# Altium project Hammerhead.PrjPCB (part 1 of 2)
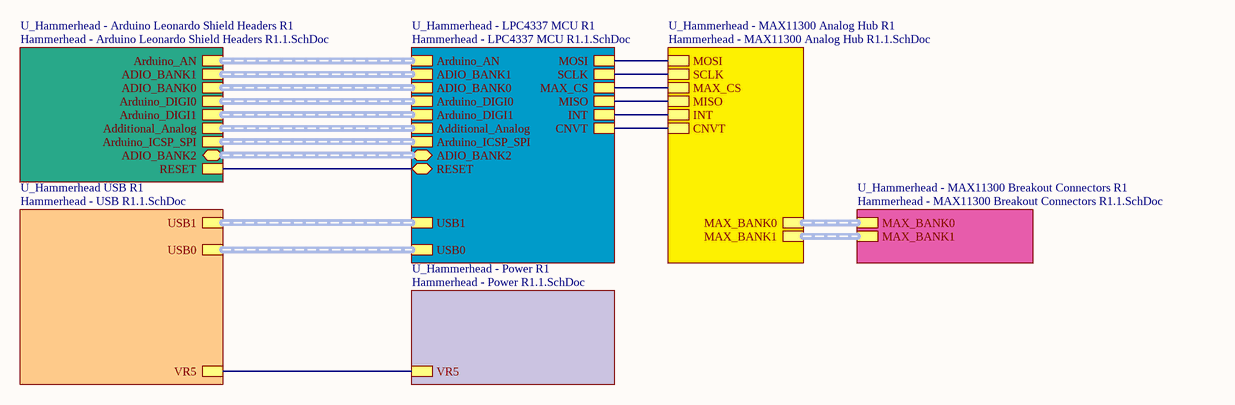
[diagram p0: Hammerhead - Master Schematic.SchDoc]
7 sheets, 195 parts. Net scope: hierarchical (ports join the sheet entries above them; power ports are global).
Board file: Hammerhead PCB R1.0.PcbDoc
Sheets:
  Hammerhead - Master Schematic.SchDoc
    U_Hammerhead - Arduino Leonardo Shield Headers R1 = Hammerhead - Arduino Leonardo Shield Headers R1.1.SchDoc
    U_Hammerhead - LPC4337 MCU R1 = Hammerhead - LPC4337 MCU R1.1.SchDoc
    U_Hammerhead - MAX11300 Analog Hub R1 = Hammerhead - MAX11300 Analog Hub R1.1.SchDoc
    U_Hammerhead - MAX11300 Breakout Connectors R1 = Hammerhead - MAX11300 Breakout Connectors R1.1.SchDoc
    U_Hammerhead - Power R1 = Hammerhead - Power R1.1.SchDoc
    U_Hammerhead USB R1 = Hammerhead - USB R1.1.SchDoc

## Sheet Hammerhead - Master Schematic.SchDoc
size A; Author: Adam Vadala-Roth; DrawnBy: Adam Vadala-Roth; Engineer: Adam Vadala-Roth; DocumentNumber: 1

### Sub-sheets
U_Hammerhead - Arduino Leonardo Shield Headers R1 = Hammerhead - Arduino Leonardo Shield Headers R1.1.SchDoc: Arduino_AN (harness Arduino_AN), Arduino_DIGI0 (harness Arduino_DIGI0), Arduino_DIGI1 (harness Arduino_DIGI1), RESET, Additional_Analog (harness ADAN), ADIO_BANK1 (harness ADIO_BANK1), ADIO_BANK0 (harness ADIO_BANK0), Arduino_ICSP_SPI (harness Arduino_ICSP_SPI), ADIO_BANK2 (harness ADIO_BANK2)
U_Hammerhead - LPC4337 MCU R1 = Hammerhead - LPC4337 MCU R1.1.SchDoc: Arduino_AN (harness Arduino_AN), ADIO_BANK1 (harness ADIO_BANK1), ADIO_BANK0 (harness ADIO_BANK0), Arduino_DIGI0 (harness Arduino_DIGI0), Arduino_DIGI1 (harness Arduino_DIGI1), Additional_Analog (harness ADAN), USB1 (harness USB1), USB0 (harness USB0), Arduino_ICSP_SPI (harness Arduino_ICSP_SPI), MOSI, SCLK, MAX_CS, MISO, INT, CNVT, RESET, ADIO_BANK2 (harness ADIO_BANK2)
U_Hammerhead - MAX11300 Analog Hub R1 = Hammerhead - MAX11300 Analog Hub R1.1.SchDoc: MOSI, SCLK, MAX_CS, MISO, INT, CNVT, MAX_BANK0 (harness MAX_BANK0), MAX_BANK1 (harness MAX_BANK1)
U_Hammerhead - MAX11300 Breakout Connectors R1 = Hammerhead - MAX11300 Breakout Connectors R1.1.SchDoc: MAX_BANK0 (harness MAX_BANK0), MAX_BANK1 (harness MAX_BANK1)
U_Hammerhead - Power R1 = Hammerhead - Power R1.1.SchDoc: VR5
U_Hammerhead USB R1 = Hammerhead - USB R1.1.SchDoc: USB1 (harness USB1), USB0 (harness USB0), VR5

### Nets
CNVT: sheet U_Hammerhead - LPC4337 MCU R1/CNVT, sheet U_Hammerhead - MAX11300 Analog Hub R1/CNVT
INT: sheet U_Hammerhead - LPC4337 MCU R1/INT, sheet U_Hammerhead - MAX11300 Analog Hub R1/INT
MAX_CS: sheet U_Hammerhead - LPC4337 MCU R1/MAX_CS, sheet U_Hammerhead - MAX11300 Analog Hub R1/MAX_CS
MISO: sheet U_Hammerhead - LPC4337 MCU R1/MISO, sheet U_Hammerhead - MAX11300 Analog Hub R1/MISO
MOSI: sheet U_Hammerhead - LPC4337 MCU R1/MOSI, sheet U_Hammerhead - MAX11300 Analog Hub R1/MOSI
RESET: sheet U_Hammerhead - Arduino Leonardo Shield Headers R1/RESET, sheet U_Hammerhead - LPC4337 MCU R1/RESET
SCLK: sheet U_Hammerhead - LPC4337 MCU R1/SCLK, sheet U_Hammerhead - MAX11300 Analog Hub R1/SCLK
NetD3_1: sheet U_Hammerhead - Power R1/VR5, sheet U_Hammerhead USB R1/VR5

### Buses and harness runs
harness sheet U_Hammerhead - Arduino Leonardo Shield Headers R1/Additional_Analog = sheet U_Hammerhead - LPC4337 MCU R1/Additional_Analog
harness sheet U_Hammerhead - Arduino Leonardo Shield Headers R1/ADIO_BANK0 = sheet U_Hammerhead - LPC4337 MCU R1/ADIO_BANK0
harness sheet U_Hammerhead - Arduino Leonardo Shield Headers R1/ADIO_BANK1 = sheet U_Hammerhead - LPC4337 MCU R1/ADIO_BANK1
harness sheet U_Hammerhead - Arduino Leonardo Shield Headers R1/ADIO_BANK2 = sheet U_Hammerhead - LPC4337 MCU R1/ADIO_BANK2
harness sheet U_Hammerhead - Arduino Leonardo Shield Headers R1/Arduino_AN = sheet U_Hammerhead - LPC4337 MCU R1/Arduino_AN
harness sheet U_Hammerhead - Arduino Leonardo Shield Headers R1/Arduino_DIGI0 = sheet U_Hammerhead - LPC4337 MCU R1/Arduino_DIGI0
harness sheet U_Hammerhead - Arduino Leonardo Shield Headers R1/Arduino_DIGI1 = sheet U_Hammerhead - LPC4337 MCU R1/Arduino_DIGI1
harness sheet U_Hammerhead - Arduino Leonardo Shield Headers R1/Arduino_ICSP_SPI = sheet U_Hammerhead - LPC4337 MCU R1/Arduino_ICSP_SPI
harness sheet U_Hammerhead - LPC4337 MCU R1/USB0 = sheet U_Hammerhead USB R1/USB0
harness sheet U_Hammerhead - LPC4337 MCU R1/USB1 = sheet U_Hammerhead USB R1/USB1
harness sheet U_Hammerhead - MAX11300 Analog Hub R1/MAX_BANK0 = sheet U_Hammerhead - MAX11300 Breakout Connectors R1/MAX_BANK0
harness sheet U_Hammerhead - MAX11300 Analog Hub R1/MAX_BANK1 = sheet U_Hammerhead - MAX11300 Breakout Connectors R1/MAX_BANK1

## Sheet Hammerhead - Arduino Leonardo Shield Headers R1.1.SchDoc
size A; SheetNumber: 5
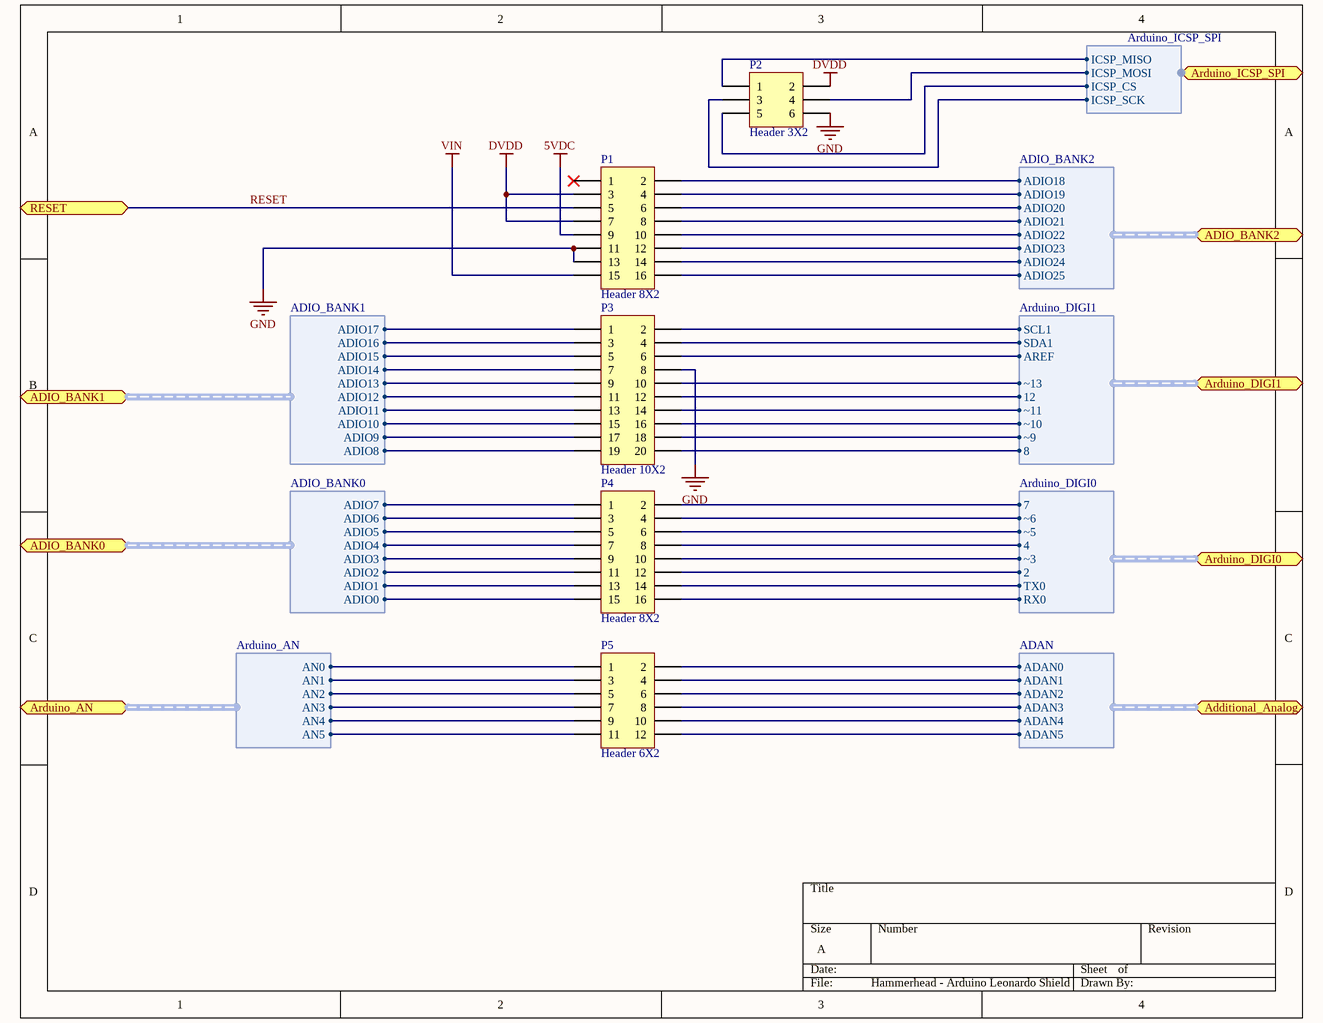
[diagram p1: Hammerhead - Arduino Leonardo Shield Headers R1.1.SchDoc]

### Parts
P1  Header 8X2  [HDR2X8]
P2  Header 3X2  [HDR2X3]
P3  Header 10X2  [HDR2X10]
P4  Header 8X2  [HDR2X8]
P5  Header 6X2  [HDR2X6]

### Ports
Additional_Analog (harness ADAN), ADIO_BANK0 (harness ADIO_BANK0), ADIO_BANK1 (harness ADIO_BANK1), ADIO_BANK2 (harness ADIO_BANK2), Arduino_AN (harness Arduino_AN), Arduino_DIGI0 (harness Arduino_DIGI0), Arduino_DIGI1 (harness Arduino_DIGI1), Arduino_ICSP_SPI (harness Arduino_ICSP_SPI), RESET

### Harnesses
Arduino_DIGI1: 8, ~9, ~10, ~11, 12, ~13, AREF, SDA1, SCL1
Arduino_DIGI0: 7, ~6, ~5, 4, ~3, 2, TX0, RX0
Arduino_AN: AN0, AN1, AN2, AN3, AN4, AN5
ADIO_BANK0: ADIO0, ADIO1, ADIO2, ADIO3, ADIO4, ADIO5, ADIO6, ADIO7
ADIO_BANK1: ADIO17, ADIO16, ADIO15, ADIO14, ADIO13, ADIO12, ADIO10, ADIO9, ADIO8, ADIO11
ADAN: ADAN0, ADAN1, ADAN2, ADAN3, ADAN4, ADAN5
Arduino_ICSP_SPI: ICSP_MOSI, ICSP_MISO, ICSP_SCK, ICSP_CS
ADIO_BANK2: ADIO18, ADIO19, ADIO20, ADIO21, ADIO22, ADIO23, ADIO24, ADIO25

### Nets
5VDC: P1.9
DVDD: P1.3 P1.7 P2.2
GND: P1.11 P1.13 P2.6 P3.8
VIN: P1.15
ADC0_5: P5.2 ; port Additional_Analog.ADAN0
ADC0_7: P5.4 ; port Additional_Analog.ADAN1
AN0: P5.1 ; port Arduino_AN.AN0
AN1: P5.3 ; port Arduino_AN.AN1
AN2: P5.5 ; port Arduino_AN.AN2
AN3: P5.7 ; port Arduino_AN.AN3
AN4: P5.9 ; port Arduino_AN.AN4
Digi_2: P4.12 ; port Arduino_DIGI0.2
GPIO1_0: P3.3 ; port ADIO_BANK1.ADIO16
GPIO1_1: P3.5 ; port ADIO_BANK1.ADIO15
GPIO1_3: P3.7 ; port ADIO_BANK1.ADIO14
GPIO1_5: P3.9 ; port ADIO_BANK1.ADIO13
GPIO1_9: P3.1 ; port ADIO_BANK1.ADIO17
GPIO1_10: P5.12 ; port Additional_Analog.ADAN5
GPIO1_12: P3.17 ; port ADIO_BANK1.ADIO9
GPIO1_13: P3.19 ; port ADIO_BANK1.ADIO8
GPIO2_0: P4.10 ; port Arduino_DIGI0.~3
GPIO2_2: P4.3 ; port ADIO_BANK0.ADIO6
GPIO2_5: P4.1 ; port ADIO_BANK0.ADIO7
GPIO2_6: P3.16 ; port Arduino_DIGI1.~10
GPIO2_7: P4.4 ; port Arduino_DIGI0.~6
GPIO2_8: P3.20 ; port Arduino_DIGI1.8
GPIO2_9: P3.18 ; port Arduino_DIGI1.~9
GPIO2_12: P3.11 ; port ADIO_BANK1.ADIO12
GPIO2_14: P4.6 ; port Arduino_DIGI0.~5
GPIO3_0: P1.2 ; port ADIO_BANK2.ADIO18
GPIO3_1: P1.6 ; port ADIO_BANK2.ADIO20
GPIO3_2: P1.8 ; port ADIO_BANK2.ADIO21
GPIO3_3: P4.14 ; port Arduino_DIGI0.TX0
GPIO3_4: P4.16 ; port Arduino_DIGI0.RX0
GPIO3_5: P4.8 ; port Arduino_DIGI0.4
GPIO3_6: P5.10 ; port Additional_Analog.ADAN4
GPIO3_8: P4.5 ; port ADIO_BANK0.ADIO5
GPIO3_9: P4.7 ; port ADIO_BANK0.ADIO4
GPIO3_10: P4.11 ; port ADIO_BANK0.ADIO2
GPIO3_11: P4.15 ; port ADIO_BANK0.ADIO0
GPIO3_14: P4.2 ; port Arduino_DIGI0.7
GPIO4_11: P3.15 ; port ADIO_BANK1.ADIO10
GPIO5_6: P5.6 ; port Additional_Analog.ADAN2
GPIO5_7: P5.8 ; port Additional_Analog.ADAN3
GPIO5_8: P4.9 ; port ADIO_BANK0.ADIO3
GPIO5_9: P4.13 ; port ADIO_BANK0.ADIO1
GPIO5_12: P3.14 ; port Arduino_DIGI1.~11
GPIO5_13: P3.12 ; port Arduino_DIGI1.12
GPIO5_14: P3.10 ; port Arduino_DIGI1.~13
GPIO5_15: P1.14 ; port ADIO_BANK2.ADIO24
GPIO5_16: P1.16 ; port ADIO_BANK2.ADIO25
GPIO5_18: P3.13 ; port ADIO_BANK1.ADIO11
I2C1_SCL: P3.2 ; port Arduino_DIGI1.SCL1
I2C1_SDA: P3.4 ; port Arduino_DIGI1.SDA1
RESET: P1.5 ; port RESET
SGPIO6: P1.12 ; port ADIO_BANK2.ADIO23
SSP1_MISO: P2.1 ; port Arduino_ICSP_SPI.ICSP_MISO
SSP1_MOSI: P2.4 ; port Arduino_ICSP_SPI.ICSP_MOSI
SSP1_SCK: P2.3 ; port Arduino_ICSP_SPI.ICSP_SCK
SSP1_SSEL: P2.5 ; port Arduino_ICSP_SPI.ICSP_CS
U0_RXD: P1.10 ; port ADIO_BANK2.ADIO22
U0_TXD: P1.4 ; port ADIO_BANK2.ADIO19
VDDA: P3.6 ; port Arduino_DIGI1.AREF
NetP5_11: P5.11 ; port Arduino_AN.AN5

Not connected (* = marked no-connect by the designer): P1 1*

### Library data of the parts
P1 P4 = Header 8X2: Header, 8-Pin, Dual row; LatestRevisionDate: 17-Jul-2002; LatestRevisionNote: Re-released for DXP Platform.; Publisher: Altium Limited
P2 = Header 3X2: Header, 3-Pin, Dual row; LatestRevisionDate: 17-Jul-2002; LatestRevisionNote: Re-released for DXP Platform.; Publisher: Altium Limited
P3 = Header 10X2: Header, 10-Pin, Dual row; LatestRevisionDate: 17-Jul-2002; LatestRevisionNote: Re-released for DXP Platform.; Publisher: Altium Limited
P5 = Header 6X2: Header, 6-Pin, Dual row; LatestRevisionDate: 17-Jul-2002; LatestRevisionNote: Re-released for DXP Platform.; Publisher: Altium Limited

## Sheet Hammerhead - LPC4337 MCU R1.1.SchDoc
size C; SheetNumber: 2
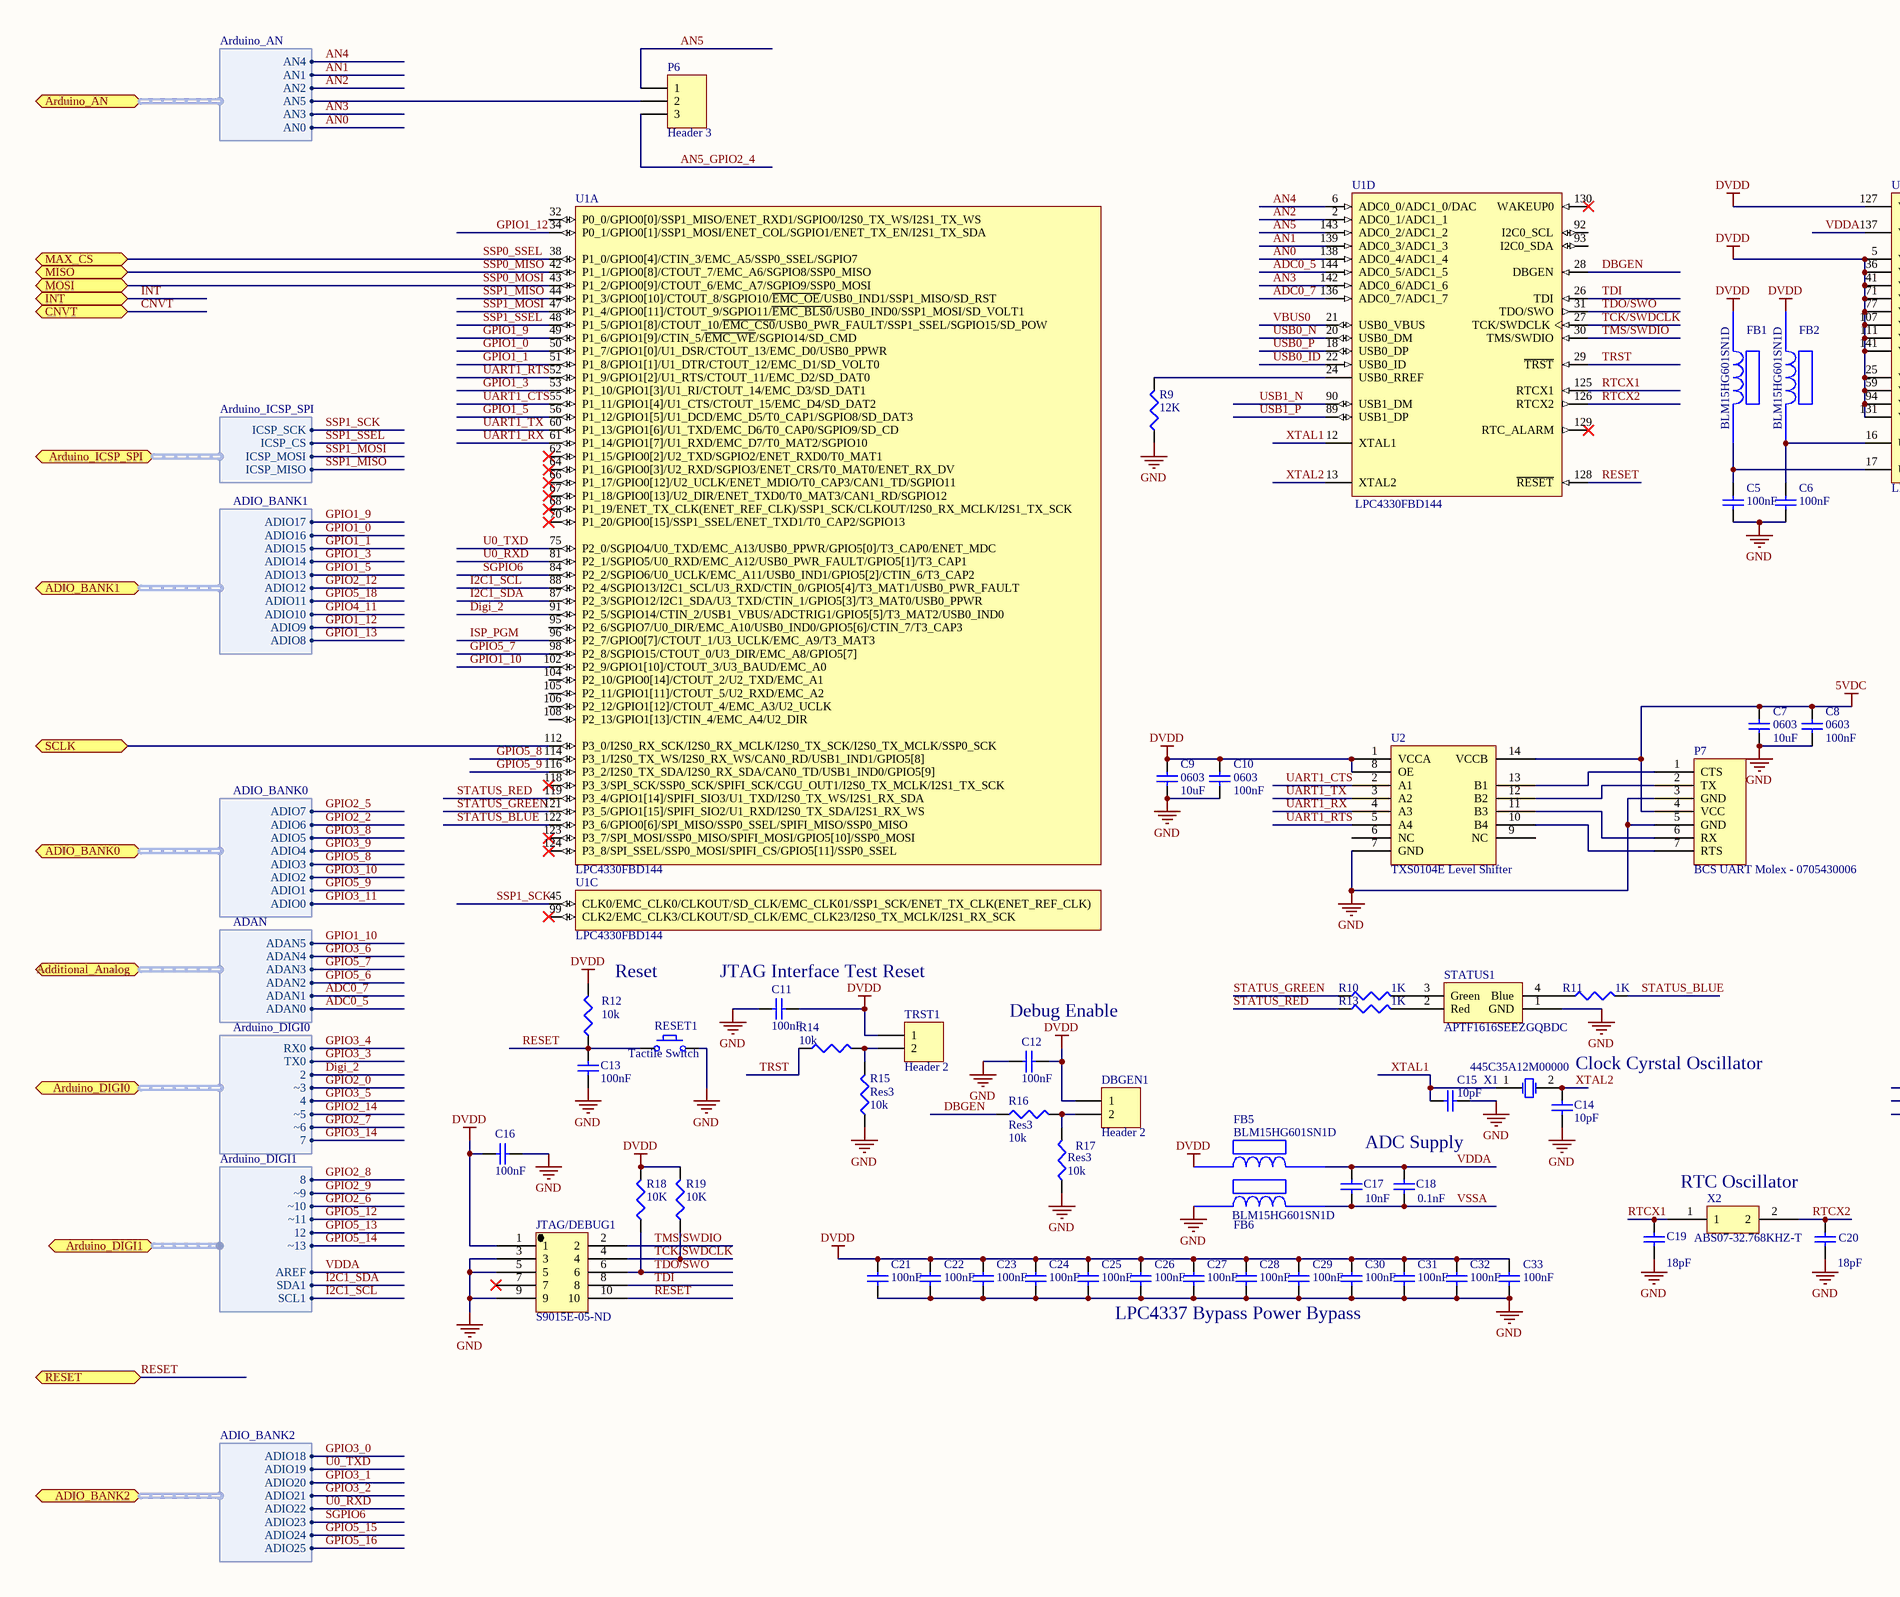
[diagram p2: Hammerhead - LPC4337 MCU R1.1.SchDoc, left]
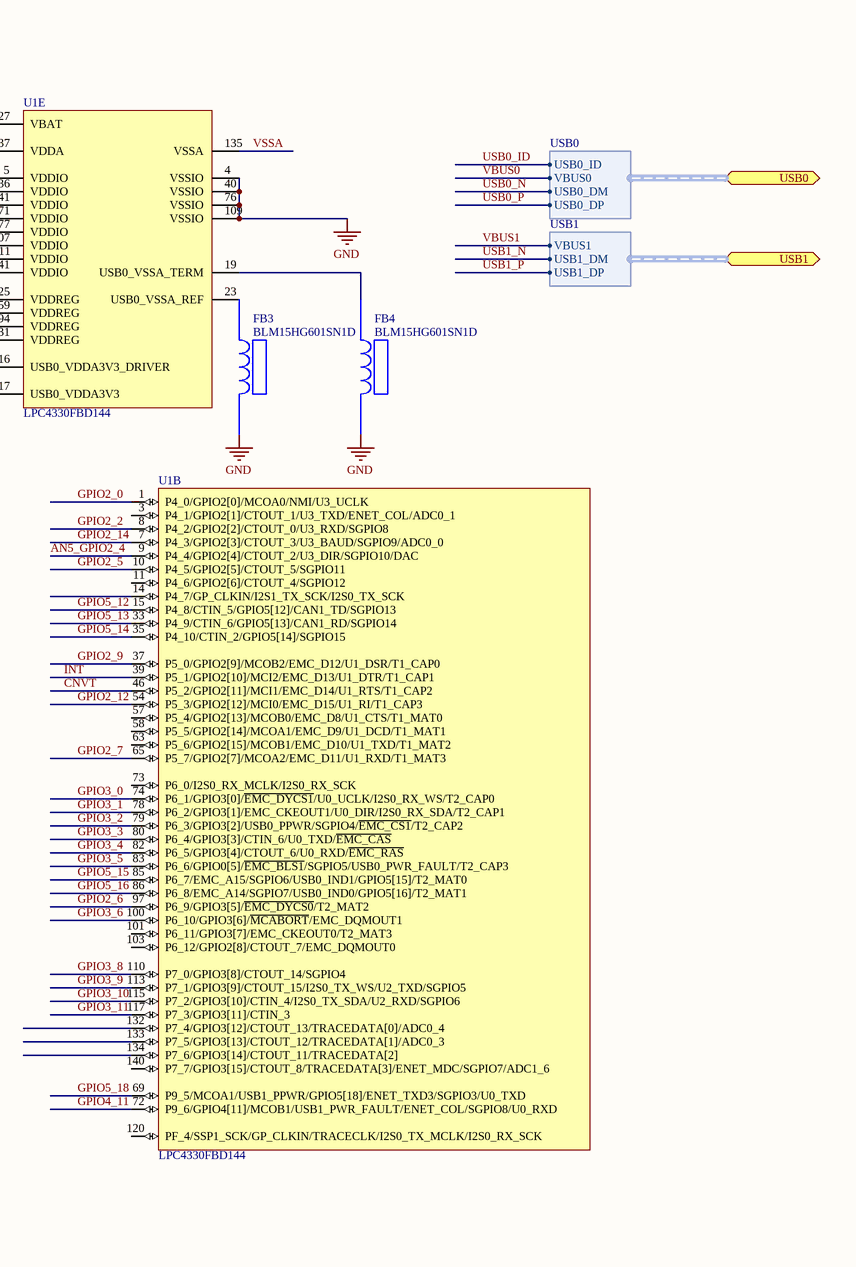
[diagram p3: Hammerhead - LPC4337 MCU R1.1.SchDoc, right]

### Parts
C5  value 100nF  [1608[0603]]  (hidden comment: Cap Semi)
C6  value 100nF  [1608[0603]]  (hidden comment: Cap Semi)
C7  0603  value 10uF  [1608[0603]]
C8  0603  value 100nF  [1608[0603]]
C9  0603  value 10uF  [1608[0603]]
C10  0603  value 100nF  [1608[0603]]
C11  value 100nF  [1608[0603]]  (hidden comment: Cap Semi)
C12  value 100nF  [1608[0603]]  (hidden comment: Cap Semi)
C13  value 100nF  [1608[0603]]  (hidden comment: Cap Semi)
C14  value 10pF  [1608[0603]]  (hidden comment: Cap Semi)
C15  value 10pF  [1608[0603]]  (hidden comment: Cap Semi)
C16  value 100nF  [1608[0603]]  (hidden comment: Cap Semi)
C17  value 10nF  [1608[0603]]  (hidden comment: Cap Semi)
C18  value 0.1nF  [1608[0603]]  (hidden comment: Cap Semi)
C19  value 18pF  [1608[0603]]  (hidden comment: Cap Semi)
C20  value 18pF  [1608[0603]]  (hidden comment: Cap Semi)
C21  value 100nF  [1608[0603]]  (hidden comment: Cap Semi)
C22  value 100nF  [1608[0603]]  (hidden comment: Cap Semi)
C23  value 100nF  [1608[0603]]  (hidden comment: Cap Semi)
C24  value 100nF  [1608[0603]]  (hidden comment: Cap Semi)
C25  value 100nF  [1608[0603]]  (hidden comment: Cap Semi)
C26  value 100nF  [1608[0603]]  (hidden comment: Cap Semi)
C27  value 100nF  [1608[0603]]  (hidden comment: Cap Semi)
C28  value 100nF  [1608[0603]]  (hidden comment: Cap Semi)
C29  value 100nF  [1608[0603]]  (hidden comment: Cap Semi)
C30  value 100nF  [1608[0603]]  (hidden comment: Cap Semi)
C31  value 100nF  [1608[0603]]  (hidden comment: Cap Semi)
C32  value 100nF  [1608[0603]]  (hidden comment: Cap Semi)
C33  value 100nF  [1608[0603]]  (hidden comment: Cap Semi)
DBGEN1  Header 2  [HDR1X2]
FB1  BLM15HG601SN1D  [BLM18PG121SN1D]
FB2  BLM15HG601SN1D  [BLM18PG121SN1D]
FB3  BLM15HG601SN1D  [BLM18PG121SN1D]
FB4  BLM15HG601SN1D  [BLM18PG121SN1D]
FB5  BLM15HG601SN1D  [BLM18PG121SN1D]
FB6  BLM15HG601SN1D  [BLM18PG121SN1D]
JTAG/DEBUG1  S9015E-05-ND  [S9015E-05-ND]
P6  Header 3  [HDR1X3]
P7  BCS UART Molex - 0705430006  [BCS Serial Port - Molex]
R9  value 12K  [J1-0603]  (hidden comment: Res3)
R10  value 1K  [J1-0603]  (hidden comment: Res3)
R11  value 1K  [J1-0603]  (hidden comment: Res3)
R12  value 10k  [J1-0603]  (hidden comment: Res3)
R13  value 1K  [J1-0603]  (hidden comment: Res3)
R14  value 10k  [J1-0603]  (hidden comment: Res3)
R15  Res3  value 10k  [J1-0603]
R16  Res3  value 10k  [J1-0603]
R17  Res3  value 10k  [J1-0603]
R18  value 10K  [J1-0603]  (hidden comment: Res3)
R19  value 10K  [J1-0603]  (hidden comment: Res3)
RESET1  Tactile Switch  [TL3301]
STATUS1  APTF1616SEEZGQBDC  [RGB LED APTF1616SEEZGQBDC]
TRST1  Header 2  [HDR1X2]
U1  LPC4330FBD144  [SOT486-1_V]  (parts A,B,C,D,E of 5)
U2  TXS0104E Level Shifter  [RGY  (S-PVQFN-N14)]
X1  445C35A12M00000  [445C35A12M00000]
X2  ABS07-32.768KHZ-T  [ABS07-32.768KHZ-T]

### Ports
Additional_Analog (harness ADAN), ADIO_BANK0 (harness ADIO_BANK0), ADIO_BANK1 (harness ADIO_BANK1), ADIO_BANK2 (harness ADIO_BANK2), Arduino_AN (harness Arduino_AN), Arduino_DIGI0 (harness Arduino_DIGI0), Arduino_DIGI1 (harness Arduino_DIGI1), Arduino_ICSP_SPI (harness Arduino_ICSP_SPI), CNVT, INT, MAX_CS, MISO, MOSI, RESET, SCLK, USB0 (harness USB0), USB1 (harness USB1)

### Harnesses
Arduino_AN: AN0, AN1, AN2, AN3, AN4, AN5
ADIO_BANK0: ADIO0, ADIO1, ADIO2, ADIO3, ADIO4, ADIO5, ADIO6, ADIO7
ADIO_BANK1: ADIO17, ADIO16, ADIO15, ADIO14, ADIO13, ADIO12, ADIO10, ADIO9, ADIO8, ADIO11
Arduino_DIGI0: 7, ~6, ~5, 4, ~3, 2, TX0, RX0
ADAN: ADAN0, ADAN1, ADAN2, ADAN3, ADAN4, ADAN5
USB1: VBUS1, USB1_DM, USB1_DP
USB0: USB0_ID, VBUS0, USB0_DM, USB0_DP
Arduino_ICSP_SPI: ICSP_MOSI, ICSP_MISO, ICSP_SCK, ICSP_CS
Arduino_DIGI1: 8, ~9, ~10, ~11, 12, ~13, AREF, SDA1, SCL1
ADIO_BANK2: ADIO18, ADIO19, ADIO20, ADIO21, ADIO22, ADIO23, ADIO24, ADIO25

### Nets
5VDC: C7.2 C8.2 P7.4(VCC) U2.14(VCCB)
DVDD: C9.2 C10.2 C11.2 C12.2 C16.1 C21.2 C22.2 C23.2 C24.2 C25.2 C26.2 C27.2 C28.2 C29.2 C30.2 C31.2 C32.2 C33.2 DBGEN1.1 FB1.1 FB2.1 FB5.1 JTAG/DEBUG1.1 R12.2 R18.2 R19.2 TRST1.1 U1.5(VDDIO) U1.25(VDDREG) U1.36(VDDIO) U1.41(VDDIO) U1.59(VDDREG) U1.71(VDDIO) U1.77(VDDIO) U1.94(VDDREG) U1.107(VDDIO) U1.111(VDDIO) U1.127(VBAT) U1.131(VDDREG) U1.141(VDDIO) U2.1(VCCA) U2.8(OE)
GND: C5.1 C6.1 C7.1 C8.1 C9.1 C10.1 C11.1 C12.1 C13.1 C14.1 C15.1 C16.2 C19.1 C20.1 C21.1 C22.1 C23.1 C24.1 C25.1 C26.1 C27.1 C28.1 C29.1 C30.1 C31.1 C32.1 C33.1 FB3.2 FB4.2 FB6.1 JTAG/DEBUG1.3 JTAG/DEBUG1.5 JTAG/DEBUG1.9 P7.3(GND) P7.5(GND) R9.1 R15.1 R17.1 RESET1.2 STATUS1.1(GND) U1.4(VSSIO) U1.40(VSSIO) U1.76(VSSIO) U1.109(VSSIO) U2.7(GND)
ADC0_5: U1.144(ADC0_5/ADC1_5) ; port Additional_Analog.ADAN0
ADC0_7: U1.136(ADC0_7/ADC1_7) ; port Additional_Analog.ADAN1
AN0: U1.138(ADC0_4/ADC1_4) ; port Arduino_AN.AN0
AN1: U1.139(ADC0_3/ADC1_3) ; port Arduino_AN.AN1
AN2: U1.2(ADC0_1/ADC1_1) ; port Arduino_AN.AN2
AN3: U1.142(ADC0_6/ADC1_6) ; port Arduino_AN.AN3
AN4: U1.6(ADC0_0/ADC1_0/DAC) ; port Arduino_AN.AN4
AN5: P6.1 U1.143(ADC0_2/ADC1_2)
AN5_GPIO2_4: P6.3 U1.9(P4_4/GPIO2[4]/CTOUT_2/U3_DIR/SGPIO10/DAC)
CNVT: U1.46(P5_2/GPIO2[11]/MCI1/EMC_D14/U1_RTS/T1_CAP2) ; port CNVT
DBGEN: R16.1 U1.28(DBGEN)
Digi_2: U1.91(P2_5/SGPIO14/CTIN_2/USB1_VBUS/ADCTRIG1/GPIO5[5]/T3_MAT2/USB0_IND0) ; port Arduino_DIGI0.2
GPIO1_0: U1.50(P1_7/GPIO1[0]/U1_DSR/CTOUT_13/EMC_D0/USB0_PPWR) ; port ADIO_BANK1.ADIO16
GPIO1_1: U1.51(P1_8/GPIO1[1]/U1_DTR/CTOUT_12/EMC_D1/SD_VOLT0) ; port ADIO_BANK1.ADIO15
GPIO1_3: U1.53(P1_10/GPIO1[3]/U1_RI/CTOUT_14/EMC_D3/SD_DAT1) ; port ADIO_BANK1.ADIO14
GPIO1_5: U1.56(P1_12/GPIO1[5]/U1_DCD/EMC_D5/T0_CAP1/SGPIO8/SD_DAT3) ; port ADIO_BANK1.ADIO13
GPIO1_9: U1.49(P1_6/GPIO1[9]/CTIN_5/~{EMC_WE}/SGPIO14/SD_CMD) ; port ADIO_BANK1.ADIO17
GPIO1_10: U1.102(P2_9/GPIO1[10]/CTOUT_3/U3_BAUD/EMC_A0) ; port Additional_Analog.ADAN5
GPIO1_12: U1.34(P0_1/GPIO0[1]/SSP1_MOSI/ENET_COL/SGPIO1/ENET_TX_EN/I2S1_TX_SDA) ; port ADIO_BANK1.ADIO9
GPIO2_0: U1.1(P4_0/GPIO2[0]/MCOA0/NMI/U3_UCLK) ; port Arduino_DIGI0.~3
GPIO2_2: U1.8(P4_2/GPIO2[2]/CTOUT_0/U3_RXD/SGPIO8) ; port ADIO_BANK0.ADIO6
GPIO2_5: U1.10(P4_5/GPIO2[5]/CTOUT_5/SGPIO11) ; port ADIO_BANK0.ADIO7
GPIO2_6: U1.97(P6_9/GPIO3[5]/~{EMC_DYCS0}/T2_MAT2) ; port Arduino_DIGI1.~10
GPIO2_7: U1.65(P5_7/GPIO2[7]/MCOA2/EMC_D11/U1_RXD/T1_MAT3) ; port Arduino_DIGI0.~6
GPIO2_9: U1.37(P5_0/GPIO2[9]/MCOB2/EMC_D12/U1_DSR/T1_CAP0) ; port Arduino_DIGI1.~9
GPIO2_12: U1.54(P5_3/GPIO2[12]/MCI0/EMC_D15/U1_RI/T1_CAP3) ; port ADIO_BANK1.ADIO12
GPIO2_14: U1.7(P4_3/GPIO2[3]/CTOUT_3/U3_BAUD/SGPIO9/ADC0_0) ; port Arduino_DIGI0.~5
GPIO3_0: U1.74(P6_1/GPIO3[0]/~{EMC_DYCS1}/U0_UCLK/I2S0_RX_WS/T2_CAP0) ; port ADIO_BANK2.ADIO18
GPIO3_1: U1.78(P6_2/GPIO3[1]/EMC_CKEOUT1/U0_DIR/I2S0_RX_SDA/T2_CAP1) ; port ADIO_BANK2.ADIO20
GPIO3_2: U1.79(P6_3/GPIO3[2]/USB0_PPWR/SGPIO4/~{EMC_CS1}/T2_CAP2) ; port ADIO_BANK2.ADIO21
GPIO3_3: U1.80(P6_4/GPIO3[3]/CTIN_6/U0_TXD/~{EMC_CAS}) ; port Arduino_DIGI0.TX0
GPIO3_4: U1.82(P6_5/GPIO3[4]/CTOUT_6/U0_RXD/~{EMC_RAS}) ; port Arduino_DIGI0.RX0
GPIO3_5: U1.83(P6_6/GPIO0[5]/~{EMC_BLS1}/SGPIO5/USB0_PWR_FAULT/T2_CAP3) ; port Arduino_DIGI0.4
GPIO3_6: U1.100(P6_10/GPIO3[6]/~{MCABORT}/EMC_DQMOUT1) ; port Additional_Analog.ADAN4
GPIO3_8: U1.110(P7_0/GPIO3[8]/CTOUT_14/SGPIO4) ; port ADIO_BANK0.ADIO5
GPIO3_9: U1.113(P7_1/GPIO3[9]/CTOUT_15/I2S0_TX_WS/U2_TXD/SGPIO5) ; port ADIO_BANK0.ADIO4
GPIO3_10: U1.115(P7_2/GPIO3[10]/CTIN_4/I2S0_TX_SDA/U2_RXD/SGPIO6) ; port ADIO_BANK0.ADIO2
GPIO3_11: U1.117(P7_3/GPIO3[11]/CTIN_3) ; port ADIO_BANK0.ADIO0
GPIO4_11: U1.72(P9_6/GPIO4[11]/MCOB1/USB1_PWR_FAULT/ENET_COL/SGPIO8/U0_RXD) ; port ADIO_BANK1.ADIO10
GPIO5_7: U1.98(P2_8/SGPIO15/CTOUT_0/U3_DIR/EMC_A8/GPIO5[7]) ; port Additional_Analog.ADAN3
GPIO5_8: U1.114(P3_1/I2S0_TX_WS/I2S0_RX_WS/CAN0_RD/USB1_IND1/GPIO5[8]) ; port ADIO_BANK0.ADIO3
GPIO5_9: U1.116(P3_2/I2S0_TX_SDA/I2S0_RX_SDA/CAN0_TD/USB1_IND0/GPIO5[9]) ; port ADIO_BANK0.ADIO1
GPIO5_12: U1.15(P4_8/CTIN_5/GPIO5[12]/CAN1_TD/SGPIO13) ; port Arduino_DIGI1.~11
GPIO5_13: U1.33(P4_9/CTIN_6/GPIO5[13]/CAN1_RD/SGPIO14) ; port Arduino_DIGI1.12
GPIO5_14: U1.35(P4_10/CTIN_2/GPIO5[14]/SGPIO15) ; port Arduino_DIGI1.~13
GPIO5_15: U1.85(P6_7/EMC_A15/SGPIO6/USB0_IND1/GPIO5[15]/T2_MAT0) ; port ADIO_BANK2.ADIO24
GPIO5_16: U1.86(P6_8/EMC_A14/SGPIO7/USB0_IND0/GPIO5[16]/T2_MAT1) ; port ADIO_BANK2.ADIO25
GPIO5_18: U1.69(P9_5/MCOA1/USB1_PPWR/GPIO5[18]/ENET_TXD3/SGPIO3/U0_TXD) ; port ADIO_BANK1.ADIO11
I2C1_SCL: U1.88(P2_4/SGPIO13/I2C1_SCL/U3_RXD/CTIN_0/GPIO5[4]/T3_MAT1/USB0_PWR_FAULT) ; port Arduino_DIGI1.SCL1
I2C1_SDA: U1.87(P2_3/SGPIO12/I2C1_SDA/U3_TXD/CTIN_1/GPIO5[3]/T3_MAT0/USB0_PPWR) ; port Arduino_DIGI1.SDA1
INT: U1.39(P5_1/GPIO2[10]/MCI2/EMC_D13/U1_DTR/T1_CAP1) ; port INT
ISP_PGM: U1.96(P2_7/GPIO0[7]/CTOUT_1/U3_UCLK/EMC_A9/T3_MAT3)
RESET: C13.2 JTAG/DEBUG1.10 R12.1 RESET1.1 U1.128(~{RESET}) ; port RESET
RTCX1: C19.2 U1.125(RTCX1) X2.1
RTCX2: C20.2 U1.126(RTCX2) X2.2
SCLK: U1.112(P3_0/I2S0_RX_SCK/I2S0_RX_MCLK/I2S0_TX_SCK/I2S0_TX_MCLK/SSP0_SCK) ; port SCLK
SGPIO6: U1.84(P2_2/SGPIO6/U0_UCLK/EMC_A11/USB0_IND1/GPIO5[2]/CTIN_6/T3_CAP2) ; port ADIO_BANK2.ADIO23
SSP0_MISO: U1.42(P1_1/GPIO0[8]/CTOUT_7/EMC_A6/SGPIO8/SSP0_MISO) ; port MISO  [project net MISO]
SSP0_MOSI: U1.43(P1_2/GPIO0[9]/CTOUT_6/EMC_A7/SGPIO9/SSP0_MOSI) ; port MOSI  [project net MOSI]
SSP0_SSEL: U1.38(P1_0/GPIO0[4]/CTIN_3/EMC_A5/SSP0_SSEL/SGPIO7) ; port MAX_CS  [project net MAX_CS]
SSP1_MISO: U1.44(P1_3/GPIO0[10]/CTOUT_8/SGPIO10/~{EMC_OE}/USB0_IND1/SSP1_MISO/SD_RST) ; port Arduino_ICSP_SPI.ICSP_MISO
SSP1_MOSI: U1.47(P1_4/GPIO0[11]/CTOUT_9/SGPIO11/~{EMC_BLS0}/USB0_IND0/SSP1_MOSI/SD_VOLT1) ; port Arduino_ICSP_SPI.ICSP_MOSI
SSP1_SCK: U1.45(CLK0/EMC_CLK0/CLKOUT/SD_CLK/EMC_CLK01/SSP1_SCK/ENET_TX_CLK(ENET_REF_CLK)) ; port Arduino_ICSP_SPI.ICSP_SCK
SSP1_SSEL: U1.48(P1_5/GPIO1[8]/CTOUT_10/~{EMC_CS0}/USB0_PWR_FAULT/SSP1_SSEL/SGPIO15/SD_POW) ; port Arduino_ICSP_SPI.ICSP_CS
STATUS_BLUE: R11.2 U1.122(P3_6/GPIO0[6]/SPI_MISO/SSP0_SSEL/SPIFI_MISO/SSP0_MISO)
STATUS_GREEN: R10.1 U1.121(P3_5/GPIO1[15]/SPIFI_SIO2/U1_RXD/I2S0_TX_SDA/I2S1_RX_WS)
STATUS_RED: R13.1 U1.119(P3_4/GPIO1[14]/SPIFI_SIO3/U1_TXD/I2S0_TX_WS/I2S1_RX_SDA)
TCK/SWDCLK: JTAG/DEBUG1.4 R19.1 U1.27(TCK/SWDCLK)
TDI: JTAG/DEBUG1.8 U1.26(TDI)
TDO/SWO: JTAG/DEBUG1.6 R18.1 U1.31(TDO/SWO)
TMS/SWDIO: JTAG/DEBUG1.2 U1.30(TMS/SWDIO)
TRST: R14.1 U1.29(~{TRST})
U0_RXD: U1.81(P2_1/SGPIO5/U0_RXD/EMC_A12/USB0_PWR_FAULT/GPIO5[1]/T3_CAP1) ; port ADIO_BANK2.ADIO22
U0_TXD: U1.75(P2_0/SGPIO4/U0_TXD/EMC_A13/USB0_PPWR/GPIO5[0]/T3_CAP0/ENET_MDC) ; port ADIO_BANK2.ADIO19
UART1_CTS: U1.55(P1_11/GPIO1[4]/U1_CTS/CTOUT_15/EMC_D4/SD_DAT2) U2.2(A1)
UART1_RTS: U1.52(P1_9/GPIO1[2]/U1_RTS/CTOUT_11/EMC_D2/SD_DAT0) U2.5(A4)
UART1_RX: U1.61(P1_14/GPIO1[7]/U1_RXD/EMC_D7/T0_MAT2/SGPIO10) U2.4(A3)
UART1_TX: U1.60(P1_13/GPIO1[6]/U1_TXD/EMC_D6/T0_CAP0/SGPIO9/SD_CD) U2.3(A2)
USB0_ID: U1.22(USB0_ID) ; port USB0.USB0_ID
USB0_N: U1.20(USB0_DM) ; port USB0.USB0_DM
USB0_P: U1.18(USB0_DP) ; port USB0.USB0_DP
USB1_N: U1.90(USB1_DM) ; port USB1.USB1_DM
USB1_P: U1.89(USB1_DP) ; port USB1.USB1_DP
VBUS0: U1.21(USB0_VBUS) ; port USB0.VBUS0
VDDA: C17.2 C18.2 FB5.2 U1.137(VDDA) ; port Arduino_DIGI1.AREF
VSSA: C17.1 C18.1 FB6.2 U1.135(VSSA)
XTAL1: C15.2 U1.12(XTAL1) X1.1(OSC1)
XTAL2: C14.2 U1.13(XTAL2) X1.2(OSC2)
NetC5_2: C5.2 FB1.2 U1.17(USB0_VDDA3V3)
NetC6_2: C6.2 FB2.2 U1.16(USB0_VDDA3V3_DRIVER)
NetDBGEN1_2: DBGEN1.2 R16.2 R17.2
NetFB3_1: FB3.1 U1.23(USB0_VSSA_REF)
NetFB4_1: FB4.1 U1.19(USB0_VSSA_TERM)
NetP5_11: P6.2 ; port Arduino_AN.AN5
NetP7_1: P7.1(CTS) U2.13(B1)
NetP7_2: P7.2(TX) U2.12(B2)
NetP7_6: P7.6(RX) U2.11(B3)
NetP7_7: P7.7(RTS) U2.10(B4)
NetR9_2: R9.2 U1.24(USB0_RREF)
NetR10_2: R10.2 STATUS1.3(Green)
NetR11_1: R11.1 STATUS1.4(Blue)
NetR13_2: R13.2 STATUS1.2(Red)
NetR14_2: R14.2 R15.2 TRST1.2

Not connected (* = marked no-connect by the designer): JTAG/DEBUG1 7*; U1 3(P4_1/GPIO2[1]/CTOUT_1/U3_TXD/ENET_COL/ADC0_1) 11(P4_6/GPIO2[6]/CTOUT_4/SGPIO12) 14(P4_7/GP_CLKIN/I2S1_TX_SCK/I2S0_TX_SCK) 32(P0_0/GPIO0[0]/SSP1_MISO/ENET_RXD1/SGPIO0/I2S0_TX_WS/I2S1_TX_WS) 57(P5_4/GPIO2[13]/MCOB0/EMC_D8/U1_CTS/T1_MAT0) 58(P5_5/GPIO2[14]/MCOA1/EMC_D9/U1_DCD/T1_MAT1) 62(P1_15/GPIO0[2]/U2_TXD/SGPIO2/ENET_RXD0/T0_MAT1)* 63(P5_6/GPIO2[15]/MCOB1/EMC_D10/U1_TXD/T1_MAT2) 64(P1_16/GPIO0[3]/U2_RXD/SGPIO3/ENET_CRS/T0_MAT0/ENET_RX_DV)* 66(P1_17/GPIO0[12]/U2_UCLK/ENET_MDIO/T0_CAP3/CAN1_TD/SGPIO11)* 67(P1_18/GPIO0[13]/U2_DIR/ENET_TXD0/T0_MAT3/CAN1_RD/SGPIO12)* 68(P1_19/ENET_TX_CLK(ENET_REF_CLK)/SSP1_SCK/CLKOUT/I2S0_RX_MCLK/I2S1_TX_SCK)* 70(P1_20/GPIO0[15]/SSP1_SSEL/ENET_TXD1/T0_CAP2/SGPIO13)* 73(P6_0/I2S0_RX_MCLK/I2S0_RX_SCK) 92(I2C0_SCL) 93(I2C0_SDA) 95(P2_6/SGPIO7/U0_DIR/EMC_A10/USB0_IND0/GPIO5[6]/CTIN_7/T3_CAP3) 99(CLK2/EMC_CLK3/CLKOUT/SD_CLK/EMC_CLK23/I2S0_TX_MCLK/I2S1_RX_SCK)* 101(P6_11/GPIO3[7]/EMC_CKEOUT0/T2_MAT3) 103(P6_12/GPIO2[8]/CTOUT_7/EMC_DQMOUT0) 104(P2_10/GPIO0[14]/CTOUT_2/U2_TXD/EMC_A1) 105(P2_11/GPIO1[11]/CTOUT_5/U2_RXD/EMC_A2) 106(P2_12/GPIO1[12]/CTOUT_4/EMC_A3/U2_UCLK) 108(P2_13/GPIO1[13]/CTIN_4/EMC_A4/U2_DIR) 118(P3_3/SPI_SCK/SSP0_SCK/SPIFI_SCK/CGU_OUT1/I2S0_TX_MCLK/I2S1_TX_SCK)* 120(PF_4/SSP1_SCK/GP_CLKIN/TRACECLK/I2S0_TX_MCLK/I2S0_RX_SCK) 123(P3_7/SPI_MOSI/SSP0_MISO/SPIFI_MOSI/GPIO5[10]/SSP0_MOSI)* 124(P3_8/SPI_SSEL/SSP0_MOSI/SPIFI_CS/GPIO5[11]/SSP0_SSEL)* 129(RTC_ALARM)* 130(WAKEUP0)* 132(P7_4/GPIO3[12]/CTOUT_13/TRACEDATA[0]/ADC0_4) 133(P7_5/GPIO3[13]/CTOUT_12/TRACEDATA[1]/ADC0_3) 134(P7_6/GPIO3[14]/CTOUT_11/TRACEDATA[2]) 140(P7_7/GPIO3[15]/CTOUT_8/TRACEDATA[3]/ENET_MDC/SGPIO7/ADC1_6); U2 6(NC) 9(NC)

### Notes on the sheet
- (near R12) Reset
- (near C11) JTAG Interface Test Reset
- (near C12) Debug Enable
- Clock Cyrstal Oscillator
- ADC Supply
- RTC Oscillator
- LPC4337 Bypass Power Bypass

### Library data of the parts
C5-C33 = Cap Semi: Capacitor (Semiconductor SIM Model); Published: 8-Jun-2000; LatestRevisionDate: 29-May-2009; LatestRevisionNote: IPC-7351 Footprint Added.; PackageReference: C1206; Publisher: Altium Limited; PackageDescription: Chip Capacitor
DBGEN1 TRST1 = Header 2: Header, 2-Pin; LatestRevisionDate: 17-Jul-2002; LatestRevisionNote: Re-released for DXP Platform.; Publisher: Altium Limited
P6 = Header 3: Header, 3-Pin; LatestRevisionDate: 17-Jul-2002; LatestRevisionNote: Re-released for DXP Platform.; Publisher: Altium Limited
P7 = BCS Serial Port - Molex: BCS UART Port Molex
R9-R19 = Res3: Resistor; Published: 8-Jun-2000; LatestRevisionDate: 29-May-2009; LatestRevisionNote: IPC-7351 Footprint Added.; PackageReference: J1-0603; Publisher: Altium Limited; PackageDescription: Chip Resistor
STATUS1 = RGB LED APTF1616SEEZGQBDC: RGB LED
U1 = LPC4330FBD144: 32-bit ARM Cortex-M4 MCU, 264 kB SRAM, 2 HS USB with on-chip PHY, Ethernet, CAN, AES, SPIFI, SGPIO, SCT, 144-Pin LQFP; fmax: 204 MHz; GPIOs: 83; SRAM: 264 kB; ROM: 64 kB; Ethernet: Y; USB: 2; ADC channels: 8; SPI: 1; UART: 4; VDD (min): 2.2 V; VDD (max): 3.6 V; Code_IEC: 136E23; DatasheetVersion: Rev.3.1, Jan-2012; PackageVersion: Feb-2003; PackageReference: SOT486-1; PackageDescription: LQFP144: Plastic Low Profile Quad Flat Package; 144 Leads; Body 20 x 20 x 1.4 mm; PWM: Y; PLL: Y; I2C: 2; CAN: 2; Timers: 4; Code_JEDEC: MS-026; ComponentLink1Description: Manufacturer URL; ComponentLink1URL: http://www.nxp.com/; ComponentLink2Description: Datasheet; ComponentLink2URL: http://www.nxp.com/documents/data_sheet/LPC4350_30_20_10.pdf
U2 = TXS0104E: TXS0104E - Bidriectional Opendrain/pushpull level shift
X1 = XTAL: Crystal Oscillator; Published: 8-Jun-2000; LatestRevisionDate: 17-Jul-2002; LatestRevisionNote: Re-released for DXP Platform.; PackageReference: R38; Publisher: Altium Limited; PackageDescription: Crystal, Thru-Hole; 2 Leads; Body 3.1 x 8.2 mm (Dia.xH)
X2 = ABS07-32.768KHZ-T: ABS07-32.768KHZ-T RTC Crystal Oscillator

## Sheet Hammerhead - MAX11300 Analog Hub R1.1.SchDoc
size A; SheetNumber: 3
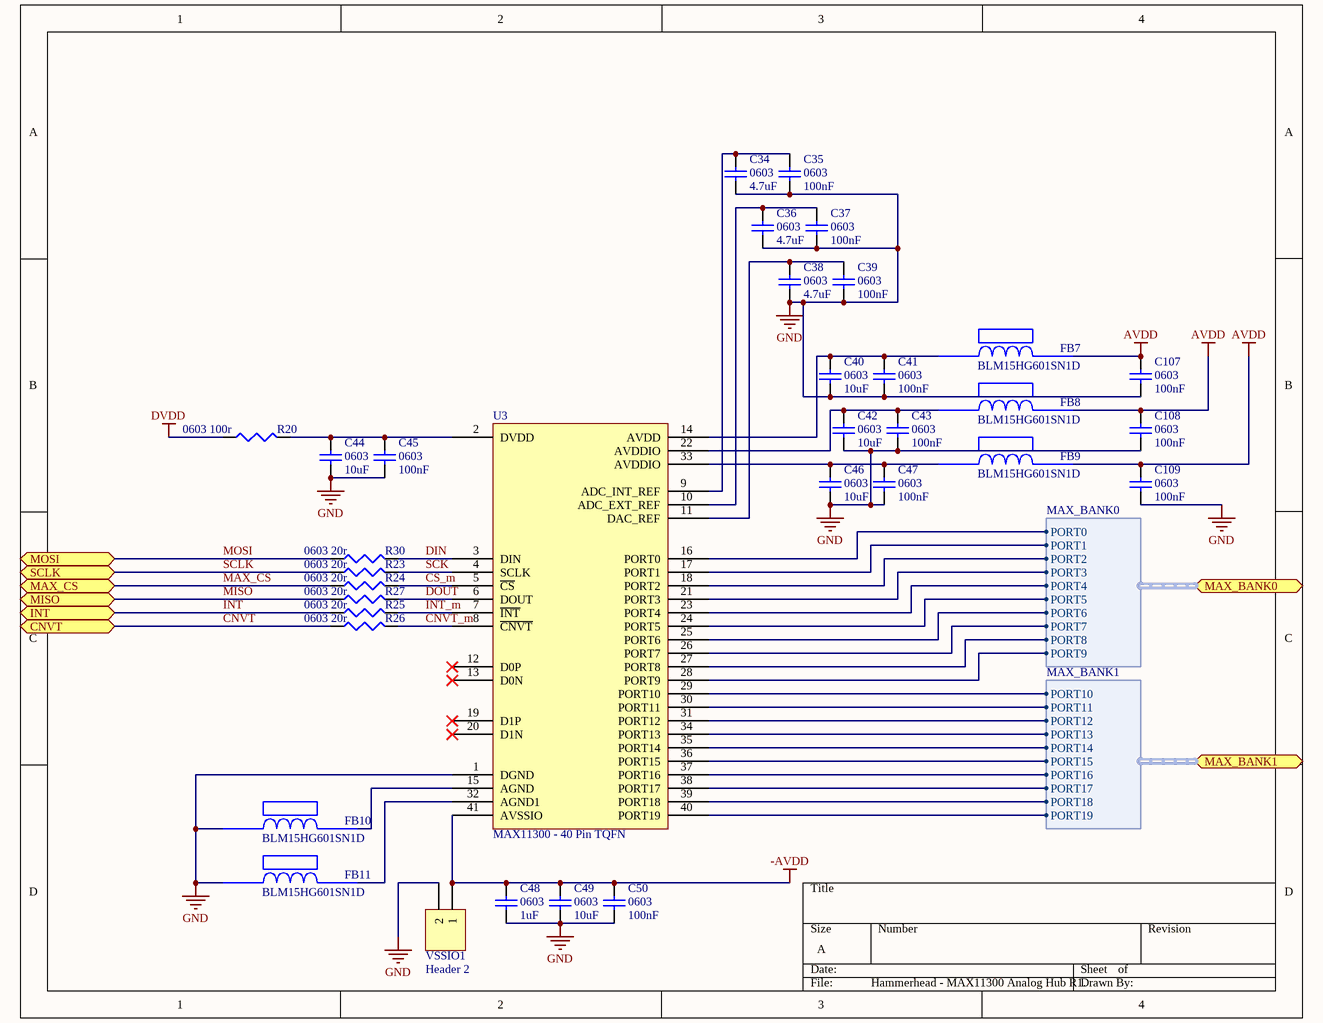
[diagram p4: Hammerhead - MAX11300 Analog Hub R1.1.SchDoc]

### Parts
C34  0603  value 4.7uF  [1608[0603]]
C35  0603  value 100nF  [1608[0603]]
C36  0603  value 4.7uF  [1608[0603]]
C37  0603  value 100nF  [1608[0603]]
C38  0603  value 4.7uF  [1608[0603]]
C39  0603  value 100nF  [1608[0603]]
C40  0603  value 10uF  [1608[0603]]
C41  0603  value 100nF  [1608[0603]]
C42  0603  value 10uF  [1608[0603]]
C43  0603  value 100nF  [1608[0603]]
C44  0603  value 10uF  [1608[0603]]
C45  0603  value 100nF  [1608[0603]]
C46  0603  value 10uF  [1608[0603]]
C47  0603  value 100nF  [1608[0603]]
C48  0603  value 1uF  [1608[0603]]
C49  0603  value 10uF  [1608[0603]]
C50  0603  value 100nF  [1608[0603]]
C107  0603  value 100nF  [1608[0603]]
C108  0603  value 100nF  [1608[0603]]
C109  0603  value 100nF  [1608[0603]]
FB7  BLM15HG601SN1D  [BLM18PG121SN1D]
FB8  BLM15HG601SN1D  [BLM18PG121SN1D]
FB9  BLM15HG601SN1D  [BLM18PG121SN1D]
FB10  BLM15HG601SN1D  [BLM18PG121SN1D]
FB11  BLM15HG601SN1D  [BLM18PG121SN1D]
R20  0603  value 100r  [J1-0603]
R23  0603  value 20r  [J1-0603]
R24  0603  value 20r  [J1-0603]
R25  0603  value 20r  [J1-0603]
R26  0603  value 20r  [J1-0603]
R27  0603  value 20r  [J1-0603]
R30  0603  value 20r  [J1-0603]
U3  MAX11300 - 40 Pin TQFN  [Maxim T4066+3 40 pin TQFN]
VSSIO1  Header 2  [HDR1X2]

### Ports
CNVT, INT, MAX_BANK0 (harness MAX_BANK0), MAX_BANK1 (harness MAX_BANK1), MAX_CS, MISO, MOSI, SCLK

### Harnesses
MAX_BANK0: PORT0, PORT1, PORT2, PORT3, PORT4, PORT5, PORT6, PORT7, PORT8, PORT9
MAX_BANK1: PORT19, PORT18, PORT17, PORT16, PORT15, PORT14, PORT13, PORT12, PORT11, PORT10

### Nets
-AVDD: C48.2 C49.2 C50.2 U3.41(AVSSIO) VSSIO1.1
AVDD: C107.2 C108.2 C109.2 FB7.2 FB8.2 FB9.2
DVDD: R20.1
GND: C34.1 C35.1 C36.1 C37.1 C38.1 C39.1 C40.1 C41.1 C42.1 C43.1 C44.1 C45.1 C46.1 C47.1 C48.1 C49.1 C50.1 C107.1 C108.1 C109.1 FB10.1 FB11.1 U3.1(DGND) VSSIO1.2
CNVT: R26.1 ; port CNVT
CNVT_m: R26.2 U3.8(~{CNVT})
CS_m: R24.2 U3.5(~{CS})
DIN: R30.2 U3.3(DIN)
DOUT: R27.2 U3.6(DOUT)
INT: R25.1 ; port INT
INT_m: R25.2 U3.7(~{INT})
MAX_CS: R24.1 ; port MAX_CS
MISO: R27.1 ; port MISO
MOSI: R30.1 ; port MOSI
SCK: R23.2 U3.4(SCLK)
SCLK: R23.1 ; port SCLK
NetC34_2: C34.2 C35.2 U3.9(ADC_INT_REF)
NetC36_2: C36.2 C37.2 U3.10(ADC_EXT_REF)
NetC38_2: C38.2 C39.2 U3.11(DAC_REF)
NetC40_2: C40.2 C41.2 FB7.1 U3.14(AVDD)
NetC42_2: C42.2 C43.2 FB8.1 U3.22(AVDDIO)
NetC44_2: C44.2 C45.2 R20.2 U3.2(DVDD)
NetC46_2: C46.2 C47.2 FB9.1 U3.33(AVDDIO)
NetFB10_2: FB10.2 U3.15(AGND)
NetFB11_2: FB11.2 U3.32(AGND1)
NetR28_1: U3.28(PORT9) ; port MAX_BANK0.PORT9
NetR29_2: U3.29(PORT10) ; port MAX_BANK1.PORT10
NetR32_1: U3.27(PORT8) ; port MAX_BANK0.PORT8
NetR33_2: U3.30(PORT11) ; port MAX_BANK1.PORT11
NetR36_1: U3.26(PORT7) ; port MAX_BANK0.PORT7
NetR37_2: U3.31(PORT12) ; port MAX_BANK1.PORT12
NetR40_1: U3.25(PORT6) ; port MAX_BANK0.PORT6
NetR41_2: U3.34(PORT13) ; port MAX_BANK1.PORT13
NetR44_1: U3.24(PORT5) ; port MAX_BANK0.PORT5
NetR45_2: U3.35(PORT14) ; port MAX_BANK1.PORT14
NetR48_1: U3.23(PORT4) ; port MAX_BANK0.PORT4
NetR49_2: U3.36(PORT15) ; port MAX_BANK1.PORT15
NetR52_1: U3.21(PORT3) ; port MAX_BANK0.PORT3
NetR53_2: U3.37(PORT16) ; port MAX_BANK1.PORT16
NetR56_1: U3.18(PORT2) ; port MAX_BANK0.PORT2
NetR57_2: U3.38(PORT17) ; port MAX_BANK1.PORT17
NetR60_1: U3.17(PORT1) ; port MAX_BANK0.PORT1
NetR61_2: U3.39(PORT18) ; port MAX_BANK1.PORT18
NetR64_1: U3.16(PORT0) ; port MAX_BANK0.PORT0
NetR65_2: U3.40(PORT19) ; port MAX_BANK1.PORT19

Not connected (* = marked no-connect by the designer): U3 12(D0P)* 13(D0N)* 19(D1P)* 20(D1N)*

### Library data of the parts
C34-C50 C107-C109 = Cap Semi: Capacitor (Semiconductor SIM Model); Published: 8-Jun-2000; LatestRevisionDate: 29-May-2009; LatestRevisionNote: IPC-7351 Footprint Added.; PackageReference: C1206; Publisher: Altium Limited; PackageDescription: Chip Capacitor
R20 R23-R27 R30 = Res3: Resistor; Published: 8-Jun-2000; LatestRevisionDate: 29-May-2009; LatestRevisionNote: IPC-7351 Footprint Added.; PackageReference: J1-0603; Publisher: Altium Limited; PackageDescription: Chip Resistor
U3 = MAX11300 - 40 Pin TQFN: MAX11300
VSSIO1 = Header 2: Header, 2-Pin; LatestRevisionDate: 17-Jul-2002; LatestRevisionNote: Re-released for DXP Platform.; Publisher: Altium Limited

## Sheet Hammerhead - MAX11300 Breakout Connectors R1.1.SchDoc
size B; SheetNumber: 4
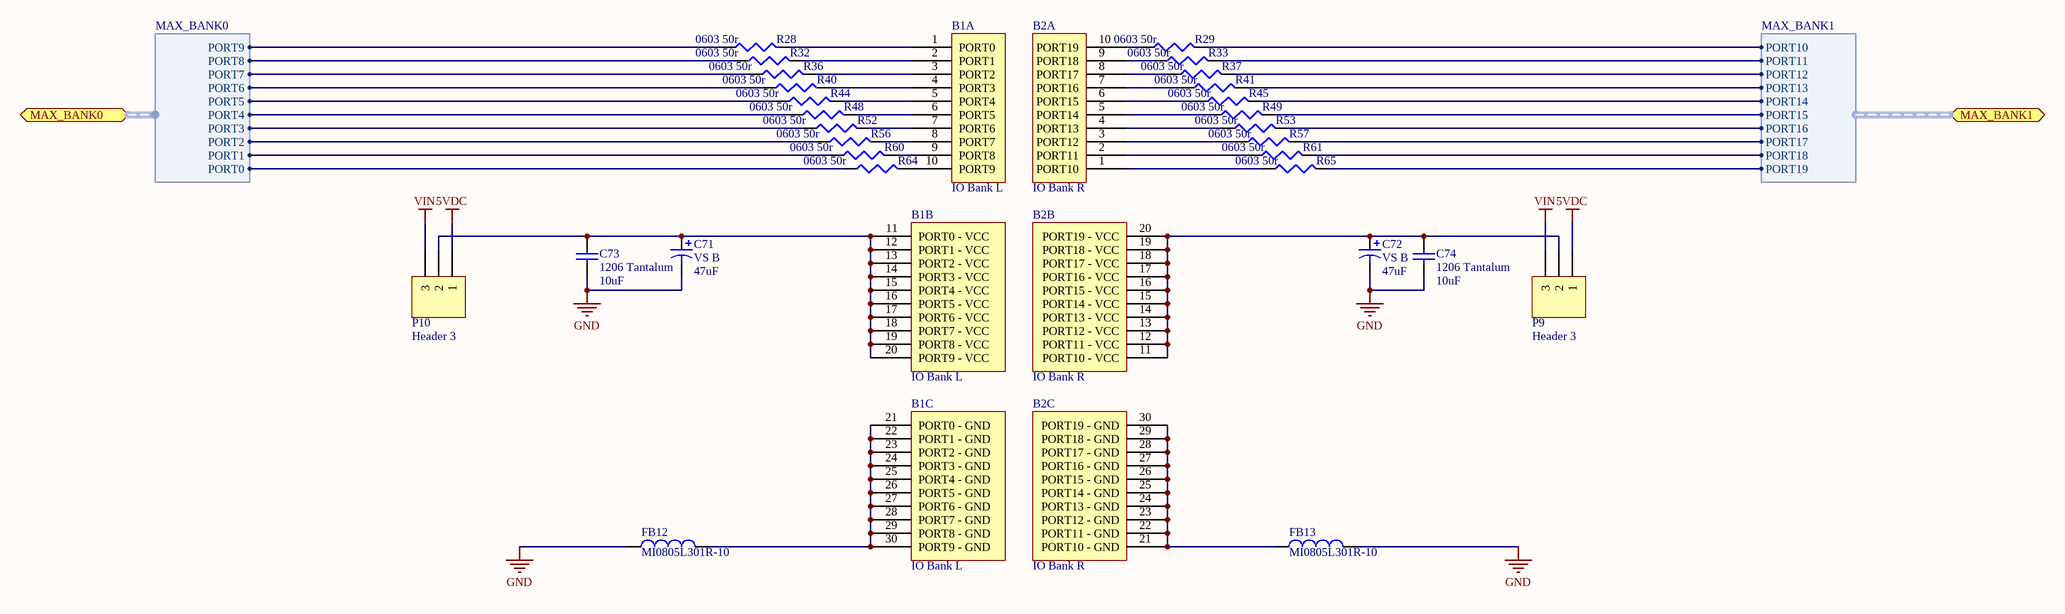
[diagram p5: Hammerhead - MAX11300 Breakout Connectors R1.1.SchDoc]

### Parts
B1  IO Bank L  [2.54mm 10X3 Header]  (parts A,B,C of 3)
B2  IO Bank R  [2.54mm 10X3 Header]  (parts A,B,C of 3)
C71  VS B  value 47uF  [Panasonic VS B]
C72  VS B  value 47uF  [Panasonic VS B]
C73  1206 Tantalum  value 10uF  [C1206]
C74  1206 Tantalum  value 10uF  [C1206]
FB12  MI0805L301R-10  [SM 0805 - gap trimmed]
FB13  MI0805L301R-10  [SM 0805 - gap trimmed]
P9  Header 3  [HDR1X3]
P10  Header 3  [HDR1X3]
R28  0603  value 50r  [J1-0603]
R29  0603  value 50r  [J1-0603]
R32  0603  value 50r  [J1-0603]
R33  0603  value 50r  [J1-0603]
R36  0603  value 50r  [J1-0603]
R37  0603  value 50r  [J1-0603]
R40  0603  value 50r  [J1-0603]
R41  0603  value 50r  [J1-0603]
R44  0603  value 50r  [J1-0603]
R45  0603  value 50r  [J1-0603]
R48  0603  value 50r  [J1-0603]
R49  0603  value 50r  [J1-0603]
R52  0603  value 50r  [J1-0603]
R53  0603  value 50r  [J1-0603]
R56  0603  value 50r  [J1-0603]
R57  0603  value 50r  [J1-0603]
R60  0603  value 50r  [J1-0603]
R61  0603  value 50r  [J1-0603]
R64  0603  value 50r  [J1-0603]
R65  0603  value 50r  [J1-0603]

### Ports
MAX_BANK0 (harness MAX_BANK0), MAX_BANK1 (harness MAX_BANK1)

### Harnesses
MAX_BANK1: PORT19, PORT18, PORT17, PORT16, PORT15, PORT14, PORT13, PORT12, PORT11, PORT10
MAX_BANK0: PORT0, PORT1, PORT2, PORT3, PORT4, PORT5, PORT6, PORT7, PORT8, PORT9

### Nets
5VDC: P9.1 P10.1
GND: C71.2 C72.2 C73.1 C74.1 FB12.1 FB13.2
VIN: P9.3 P10.3
NetB1_1: B1.1(PORT0) R28.2
NetB1_2: B1.2(PORT1) R32.2
NetB1_3: B1.3(PORT2) R36.2
NetB1_4: B1.4(PORT3) R40.2
NetB1_5: B1.5(PORT4) R44.2
NetB1_6: B1.6(PORT5) R48.2
NetB1_7: B1.7(PORT6) R52.2
NetB1_8: B1.8(PORT7) R56.2
NetB1_9: B1.9(PORT8) R60.2
NetB1_10: B1.10(PORT9) R64.2
NetB1_11: B1.11(PORT0_-_VCC) B1.12(PORT1_-_VCC) B1.13(PORT2_-_VCC) B1.14(PORT3_-_VCC) B1.15(PORT4_-_VCC) B1.16(PORT5_-_VCC) B1.17(PORT6_-_VCC) B1.18(PORT7_-_VCC) B1.19(PORT8_-_VCC) B1.20(PORT9_-_VCC) C71.1 C73.2 P10.2
NetB1_21: B1.21(PORT0_-_GND) B1.22(PORT1_-_GND) B1.23(PORT2_-_GND) B1.24(PORT3_-_GND) B1.25(PORT4_-_GND) B1.26(PORT5_-_GND) B1.27(PORT6_-_GND) B1.28(PORT7_-_GND) B1.29(PORT8_-_GND) B1.30(PORT9_-_GND) FB12.2
NetB2_1: B2.1(PORT10) R65.1
NetB2_2: B2.2(PORT11) R61.1
NetB2_3: B2.3(PORT12) R57.1
NetB2_4: B2.4(PORT13) R53.1
NetB2_5: B2.5(PORT14) R49.1
NetB2_6: B2.6(PORT15) R45.1
NetB2_7: B2.7(PORT16) R41.1
NetB2_8: B2.8(PORT17) R37.1
NetB2_9: B2.9(PORT18) R33.1
NetB2_10: B2.10(PORT19) R29.1
NetB2_11: B2.11(PORT10_-_VCC) B2.12(PORT11_-_VCC) B2.13(PORT12_-_VCC) B2.14(PORT13_-_VCC) B2.15(PORT14_-_VCC) B2.16(PORT15_-_VCC) B2.17(PORT16_-_VCC) B2.18(PORT17_-_VCC) B2.19(PORT18_-_VCC) B2.20(PORT19_-_VCC) C72.1 C74.2 P9.2
NetB2_21: B2.21(PORT10_-_GND) B2.22(PORT11_-_GND) B2.23(PORT12_-_GND) B2.24(PORT13_-_GND) B2.25(PORT14_-_GND) B2.26(PORT15_-_GND) B2.27(PORT16_-_GND) B2.28(PORT17_-_GND) B2.29(PORT18_-_GND) B2.30(PORT19_-_GND) FB13.1
NetR28_1: R28.1 ; port MAX_BANK0.PORT9
NetR29_2: R29.2 ; port MAX_BANK1.PORT10
NetR32_1: R32.1 ; port MAX_BANK0.PORT8
NetR33_2: R33.2 ; port MAX_BANK1.PORT11
NetR36_1: R36.1 ; port MAX_BANK0.PORT7
NetR37_2: R37.2 ; port MAX_BANK1.PORT12
NetR40_1: R40.1 ; port MAX_BANK0.PORT6
NetR41_2: R41.2 ; port MAX_BANK1.PORT13
NetR44_1: R44.1 ; port MAX_BANK0.PORT5
NetR45_2: R45.2 ; port MAX_BANK1.PORT14
NetR48_1: R48.1 ; port MAX_BANK0.PORT4
NetR49_2: R49.2 ; port MAX_BANK1.PORT15
NetR52_1: R52.1 ; port MAX_BANK0.PORT3
NetR53_2: R53.2 ; port MAX_BANK1.PORT16
NetR56_1: R56.1 ; port MAX_BANK0.PORT2
NetR57_2: R57.2 ; port MAX_BANK1.PORT17
NetR60_1: R60.1 ; port MAX_BANK0.PORT1
NetR61_2: R61.2 ; port MAX_BANK1.PORT18
NetR64_1: R64.1 ; port MAX_BANK0.PORT0
NetR65_2: R65.2 ; port MAX_BANK1.PORT19

### Library data of the parts
C71 C72 = Cap Pol1: Polarized Capacitor (Radial); Published: 8-Jun-2000; LatestRevisionDate: 17-Jul-2002; LatestRevisionNote: Re-released for DXP Platform.; PackageReference: RB7.6-15; Publisher: Altium Limited; PackageDescription: Polarized Capacitor (Radial); 2 Leads
C73 C74 = Cap Semi: Capacitor (Semiconductor SIM Model); Published: 8-Jun-2000; LatestRevisionDate: 29-May-2009; LatestRevisionNote: IPC-7351 Footprint Added.; PackageReference: C1206; Publisher: Altium Limited; PackageDescription: Chip Capacitor
FB12 FB13 = Inductor: Code_IEC: 1005; Published: 8-Jun-2000; LatestRevisionDate: 17-Jul-2002; LatestRevisionNote: Re-released for DXP Platform.; PackageReference: 0402-A; Publisher: Altium Limited; Code_JEITA: 0402
P9 P10 = Header 3: Header, 3-Pin; LatestRevisionDate: 17-Jul-2002; LatestRevisionNote: Re-released for DXP Platform.; Publisher: Altium Limited
R28 R29 R32 R33 R36 R37 R40 R41 R44 R45 R48 R49 R52 R53 R56 R57 R60 R61 R64 R65 = Res3: Resistor; Published: 8-Jun-2000; LatestRevisionDate: 29-May-2009; LatestRevisionNote: IPC-7351 Footprint Added.; PackageReference: J1-0603; Publisher: Altium Limited; PackageDescription: Chip Resistor

## Sheet Hammerhead - Power R1.1.SchDoc
size A; SheetNumber: 7
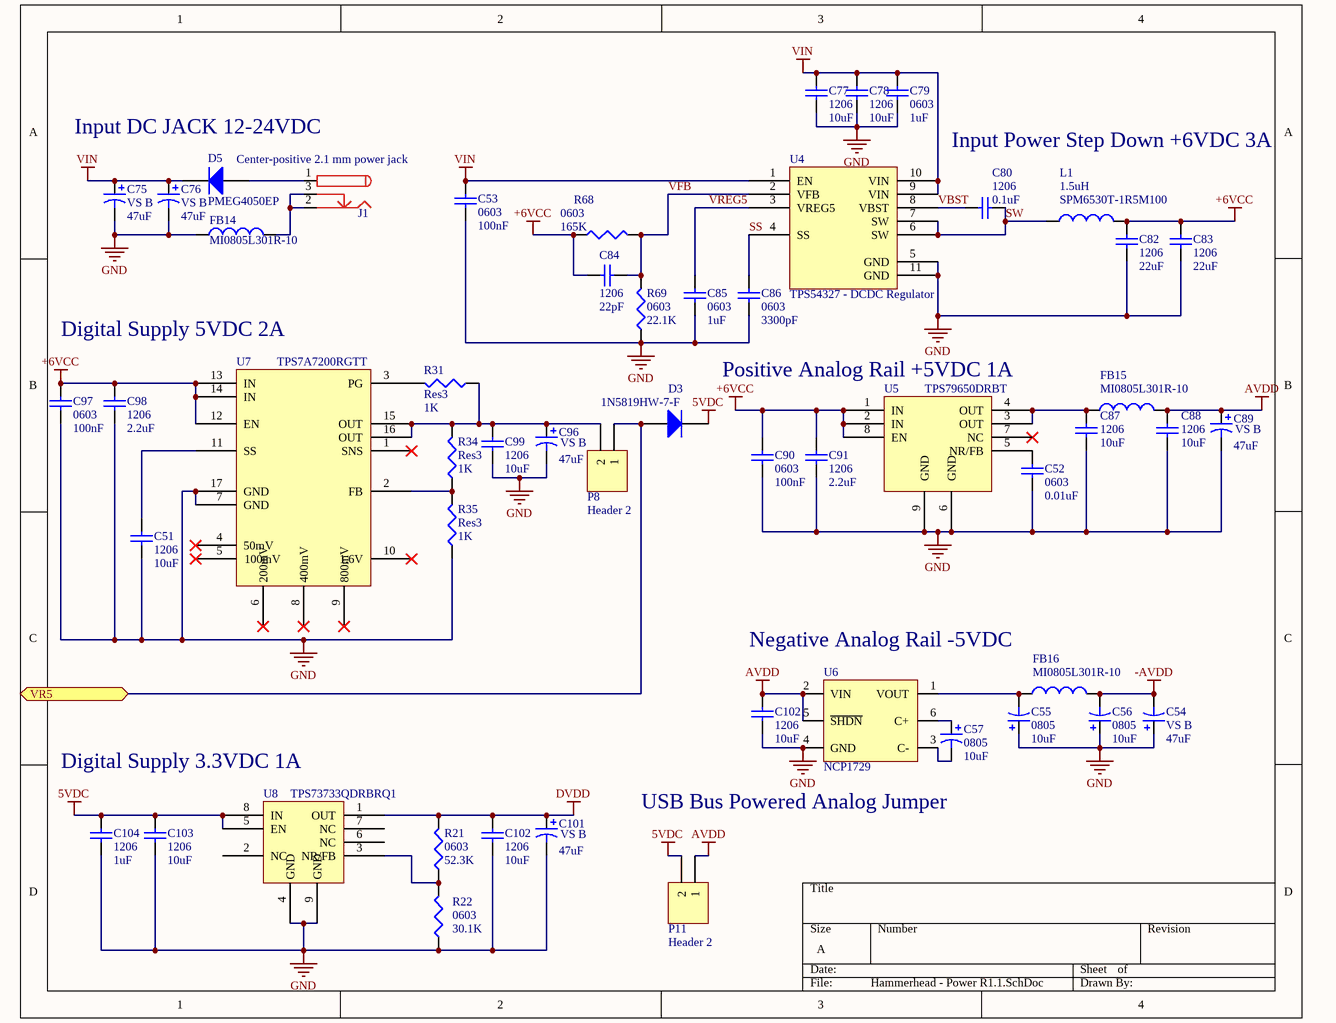
[diagram p6: Hammerhead - Power R1.1.SchDoc]

### Parts
(Parts that share a designator on the sheet are numbered #1, #2 ... from top to bottom, then left to right.)
C51  1206  value 10uF  [C1206]
C52  0603  value 0.01uF  [1608[0603]]
C53  0603  value 100nF  [1608[0603]]
C54  VS B  value 47uF  [Panasonic VS B]
C55  0805  value 10uF  [C0805]
C56  0805  value 10uF  [C0805]
C57  0805  value 10uF  [C0805]
C75  VS B  value 47uF  [Panasonic VS B]
C76  VS B  value 47uF  [Panasonic VS B]
C77  1206  value 10uF  [C1206]
C78  1206  value 10uF  [C1206]
C79  0603  value 1uF  [1608[0603]]
C80  1206  value 0.1uF  [C1206]
C82  1206  value 22uF  [C1206]
C83  1206  value 22uF  [C1206]
C84  1206  value 22pF  [C1206]
C85  0603  value 1uF  [1608[0603]]
C86  0603  value 3300pF  [1608[0603]]
C87  1206  value 10uF  [C1206]
C88  1206  value 10uF  [C1206]
C89  VS B  value 47uF  [Panasonic VS B]
C90  0603  value 100nF  [1608[0603]]
C91  1206  value 2.2uF  [C1206]
C96  VS B  value 47uF  [Panasonic VS B]
C97  0603  value 100nF  [1608[0603]]
C98  1206  value 2.2uF  [C1206]
C99  1206  value 10uF  [C1206]
C101  VS B  value 47uF  [Panasonic VS B]
C102#1  1206  value 10uF  [C1206]
C102#2  1206  value 10uF  [C1206]
C103  1206  value 10uF  [C1206]
C104  1206  value 1uF  [C1206]
D3  1N5819HW-7-F  [DIOM2715X14N]
D5  PMEG4050EP  [PMEG4050EP]
FB14  MI0805L301R-10  [SM 0805 - gap trimmed]
FB15  MI0805L301R-10  [SM 0805 - gap trimmed]
FB16  MI0805L301R-10  [SM 0805 - gap trimmed]
J1  Center-positive 2.1 mm power jack  [PJ-102AH]
L1  SPM6530T-1R5M100  value 1.5uH  [SPM6530T]
P8  Header 2  [HDR1X2]
P11  Header 2  [HDR1X2]
R21  0603  value 52.3K  [J1-0603]
R22  0603  value 30.1K  [J1-0603]
R31  Res3  value 1K  [J1-0603]
R34  Res3  value 1K  [J1-0603]
R35  Res3  value 1K  [J1-0603]
R68  0603  value 165K  [J1-0603]
R69  0603  value 22.1K  [J1-0603]
U4  TPS54327 - DCDC Regulator  [TPS54327]
U5  TPS79650DRBT  [QFN65P300X300X100_HS-17N]
U6  NCP1729  [SOT6]
U7  TPS7A7200RGTT  [QFN50P300X300X100_HS-17N]
U8  TPS73733QDRBRQ1  [QFN65P300X300X100_HS-17N - smaller pad]

### Ports
VR5

### Nets
5VDC: C103.2 C104.2 D3.2(K) P11.2 U8.5(EN) U8.8(IN)
+6VCC: C82.2 C83.2 C84.1 C90.2 C91.2 C97.2 C98.2 L1.2 R68.1 U5.1(IN) U5.2(IN) U5.8(EN) U7.12(EN) U7.13(IN) U7.14(IN)
-AVDD: C54.2 C56.2 FB16.2
AVDD: C88.2 C89.1 C102#1.2 FB15.2 P11.1 U6.2(VIN) U6.5(~{SHDN})
DVDD: C101.1 C102#2.2 R21.2 U8.1(OUT)
GND: C51.1 C52.1 C53.1 C54.1 C55.1 C56.1 C75.2 C76.2 C77.1 C78.1 C79.1 C82.1 C83.1 C85.1 C86.1 C87.1 C88.1 C89.2 C90.1 C91.1 C96.2 C97.1 C98.1 C99.1 C101.2 C102#1.1 C102#2.1 C103.1 C104.1 FB14.1 R22.1 R35.1 R69.1 U4.5(GND) U4.11(GND) U5.6(GND) U5.9(GND) U6.4(GND) U7.7(GND) U7.17(GND) U8.4(GND) U8.9(GND)
VIN: C53.2 C75.1 C76.1 C77.2 C78.2 C79.2 D5.1(A) U4.1(EN) U4.9(VIN) U4.10(VIN)
SS: C86.2 U4.4(SS)
SW: C80.2 L1.1 U4.6(SW) U4.7(SW)
VBST: C80.1 U4.8(VBST)
VFB: C84.2 R68.2 R69.2 U4.2(VFB)
VREG5: C85.2 U4.3(VREG5)
NetC51_2: C51.2 U7.11(SS)
NetC52_2: C52.2 U5.5(NR/FB)
NetC55_2: C55.2 FB16.1 U6.1(VOUT)
NetC57_1: C57.1 U6.6(C+)
NetC57_2: C57.2 U6.3(C-)
NetC87_2: C87.2 FB15.1 U5.3(OUT) U5.4(OUT)
NetC96_1: C96.1 C99.2 P8.2 R31.1 R34.2 U7.15(OUT) U7.16(OUT)
NetD3_1: D3.1(A) P8.1 ; port VR5
NetD5_2: D5.2(K) J1.1
NetFB14_2: FB14.2 J1.2 J1.3
NetR21_1: R21.1 R22.2 U8.3(NR/FB)
NetR31_2: R31.2 U7.3(PG)
NetR34_1: R34.1 R35.2 U7.2(FB)

Not connected (* = marked no-connect by the designer): U5 7(NC)*; U7 1(SNS)* 4(50mV)* 5(100mV)* 6(200mV)* 8(400mV)* 9(800mV)* 10(1.6V)*; U8 2(NC) 6(NC) 7(NC)

### Notes on the sheet
- Input DC JACK 12-24VDC
- Input Power Step Down +6VDC 3A
- Digital Supply 5VDC 2A
- (near U5) Positive Analog Rail +5VDC 1A
- Negative Analog Rail -5VDC
- Digital Supply 3.3VDC 1A
- USB Bus Powered Analog Jumper

### Library data of the parts
C51-C53 C77-C80 C82-C88 C90 C91 C97-C99 C102#1 C102#2 C103 C104 = Cap Semi: Capacitor (Semiconductor SIM Model); Published: 8-Jun-2000; LatestRevisionDate: 29-May-2009; LatestRevisionNote: IPC-7351 Footprint Added.; PackageReference: C1206; Publisher: Altium Limited; PackageDescription: Chip Capacitor
C54-C57 C75 C76 C89 C96 C101 = Cap Pol3: Polarized Capacitor (Surface Mount); Published: 8-Jun-2000; LatestRevisionDate: 29-May-2009; LatestRevisionNote: IPC-7351 Footprint Added.; PackageReference: C0805; Publisher: Altium Limited; PackageDescription: Chip Capacitor
D5 = Diode: Default Diode; Published: 8-Jun-2000; LatestRevisionDate: 17-Jul-2002; LatestRevisionNote: Re-released for DXP Platform.; PackageVersion: Sep-1996; PackageReference: SMC; Publisher: Altium Limited; PackageDescription: DO-214-AB/SMC; 2 C-Bend Leads; Body 7.9 x 5.9 mm, inc. leads (LxW); Code_JEDEC: DO-214-AB
FB14-FB16 L1 = Inductor: Code_IEC: 1005; Published: 8-Jun-2000; PackageReference: 0402-A; Publisher: Altium Limited; Code_JEITA: 0402
  FB14-FB16: LatestRevisionDate: 17-Jul-2002; LatestRevisionNote: Re-released for DXP Platform.
  L1: LatestRevisionDate: 29-May-2009; LatestRevisionNote: IPC-7351 Footprint Added.; PackageDescription: Chip Inductor
J1 = PWR2.5: Power jack; Published: 17-Dec-2003; DatasheetDocument: 09-May-2002; Publisher: Altium Limited; ComponentLink1Description: Manufacturer Link; ComponentLink1URL: http://domino.kycon.com/internet/Products.html
P8 P11 = Header 2: Header, 2-Pin; LatestRevisionDate: 17-Jul-2002; LatestRevisionNote: Re-released for DXP Platform.; Publisher: Altium Limited
R21 R22 R31 R34 R35 R68 R69 = Res3: Resistor; Published: 8-Jun-2000; LatestRevisionDate: 29-May-2009; LatestRevisionNote: IPC-7351 Footprint Added.; PackageReference: J1-0603; Publisher: Altium Limited; PackageDescription: Chip Resistor
U5 = TPS796
U8 = TPS73733-Q1
D3 = 1N5819HW-7-F: Published: 8-Jun-2000; LatestRevisionDate: 17-Jul-2002; LatestRevisionNote: Re-released for DXP Platform.; PackageVersion: Sep-1996; PackageReference: SMC; Publisher: Altium Limited; PackageDescription: DO-214-AB/SMC; 2 C-Bend Leads; Body 7.9 x 5.9 mm, inc. leads (LxW); Code_JEDEC: DO-214-AB

## Sheet Hammerhead - USB R1.1.SchDoc
size A; SheetNumber: 6
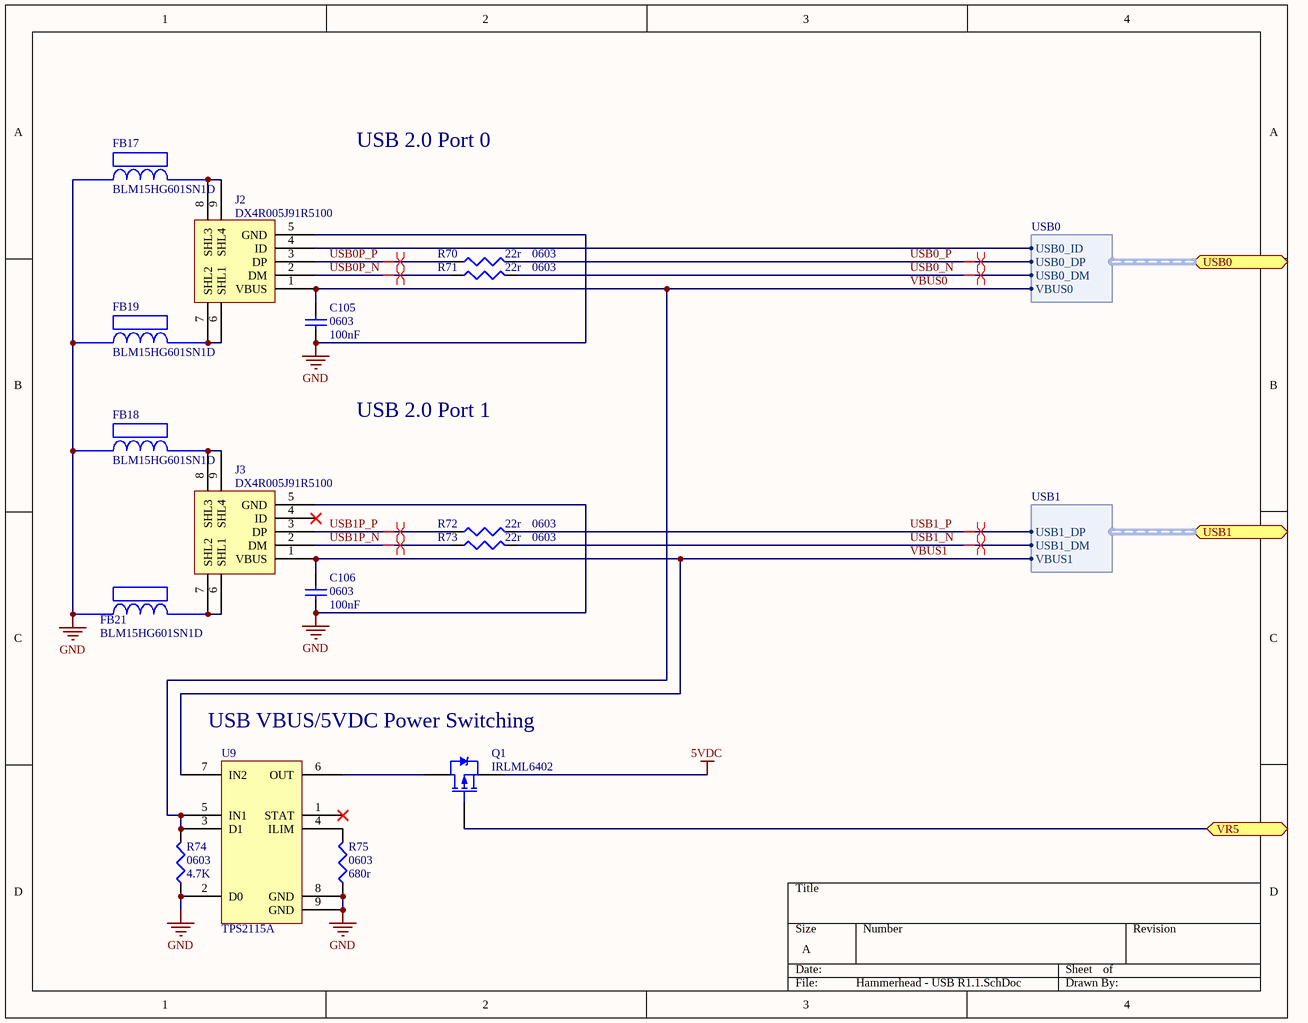
[diagram p7: Hammerhead - USB R1.1.SchDoc]

### Parts
C105  0603  value 100nF  [1608[0603]]
C106  0603  value 100nF  [1608[0603]]
FB17  BLM15HG601SN1D  [BLM18PG121SN1D]
FB18  BLM15HG601SN1D  [BLM18PG121SN1D]
FB19  BLM15HG601SN1D  [BLM18PG121SN1D]
FB21  BLM15HG601SN1D  [BLM18PG121SN1D]
J2  DX4R005J91R5100  [Micro USB Circular Holes Only]
J3  DX4R005J91R5100  [Micro USB Circular Holes Only]
Q1  IRLML6402  [SOT95P237X112-3N]
R70  0603  value 22r  [J1-0603]
R71  0603  value 22r  [J1-0603]
R72  0603  value 22r  [J1-0603]
R73  0603  value 22r  [J1-0603]
R74  0603  value 4.7K  [J1-0603]
R75  0603  value 680r  [J1-0603]
U9  TPS2115A  [DRB S-PVSON-N8]

### Ports
USB0 (harness USB0), USB1 (harness USB1), VR5

### Harnesses
USB1: VBUS1, USB1_DM, USB1_DP
USB0: USB0_ID, VBUS0, USB0_DM, USB0_DP

### Nets
5VDC: Q1.3(S)
GND: C105.1 C106.1 FB17.1 FB18.1 FB19.1 FB21.1 J2.5(GND) J3.5(GND) R74.1 R75.1 U9.2(D0) U9.8(GND) U9.9(GND)
USB0_ID: J2.4(ID) ; port USB0.USB0_ID
USB0_N: R71.2 ; port USB0.USB0_DM
USB0_P: R70.2 ; port USB0.USB0_DP
USB0P_N: J2.2(DM) R71.1
USB0P_P: J2.3(DP) R70.1
USB1_N: R73.2 ; port USB1.USB1_DM
USB1_P: R72.2 ; port USB1.USB1_DP
USB1P_N: J3.2(DM) R73.1
USB1P_P: J3.3(DP) R72.1
VBUS0: C105.2 J2.1(VBUS) R74.2 U9.3(D1) U9.5(IN1) ; port USB0.VBUS0
VBUS1: C106.2 J3.1(VBUS) U9.7(IN2) ; port USB1.VBUS1
NetD3_1: Q1.1(G) ; port VR5
NetFB17_2: FB17.2 J2.8(SHL3) J2.9(SHL4)
NetFB18_2: FB18.2 J3.8(SHL3) J3.9(SHL4)
NetFB19_2: FB19.2 J2.6(SHL1) J2.7(SHL2)
NetFB21_2: FB21.2 J3.6(SHL1) J3.7(SHL2)
NetQ1_2: Q1.2(D) U9.6(OUT)
NetR75_2: R75.2 U9.4(ILIM)

Not connected (* = marked no-connect by the designer): J3 4(ID)*; U9 1(STAT)*

### Layout directives
differential pair: USB0_N, USB0_P, USB0P_N, USB0P_P, USB1_N, USB1_P, USB1P_N, USB1P_P

### Notes on the sheet
- USB 2.0 Port 0
- USB 2.0 Port 1
- USB VBUS/5VDC Power Switching

### Library data of the parts
C105 C106 = Cap Semi: Capacitor (Semiconductor SIM Model); Published: 8-Jun-2000; LatestRevisionDate: 29-May-2009; LatestRevisionNote: IPC-7351 Footprint Added.; PackageReference: C1206; Publisher: Altium Limited; PackageDescription: Chip Capacitor
J2 J3 = Micro USB: Micro USB Jack B
Q1 = PMOS-2: P-Channel Power MOSFET; Note: Pin 4 not drawn and electrically connected to Pin 2.; Published: 8-Jun-2000; LatestRevisionDate: 17-Jul-2002; LatestRevisionNote: Re-released for DXP Platform.; DatasheetVersion: PD-9.390D; PackageVersion: Feb-1997; PackageReference: TO-220AB; Publisher: Altium Limited; PackageDescription: TO, Thru-Hole, Vertical, Heatsink Mounted; 3 In-Line Leads; Pitch 2.54 mm; ComponentLink1Description: Manufacturer Link; ComponentLink1URL: http://www.irf.com/
R70-R75 = Res3: Resistor; Published: 8-Jun-2000; LatestRevisionDate: 29-May-2009; LatestRevisionNote: IPC-7351 Footprint Added.; PackageReference: J1-0603; Publisher: Altium Limited; PackageDescription: Chip Resistor